# Altium project SCOM_2_IN_1_JLC_STACKUP_PROD.PrjPcb
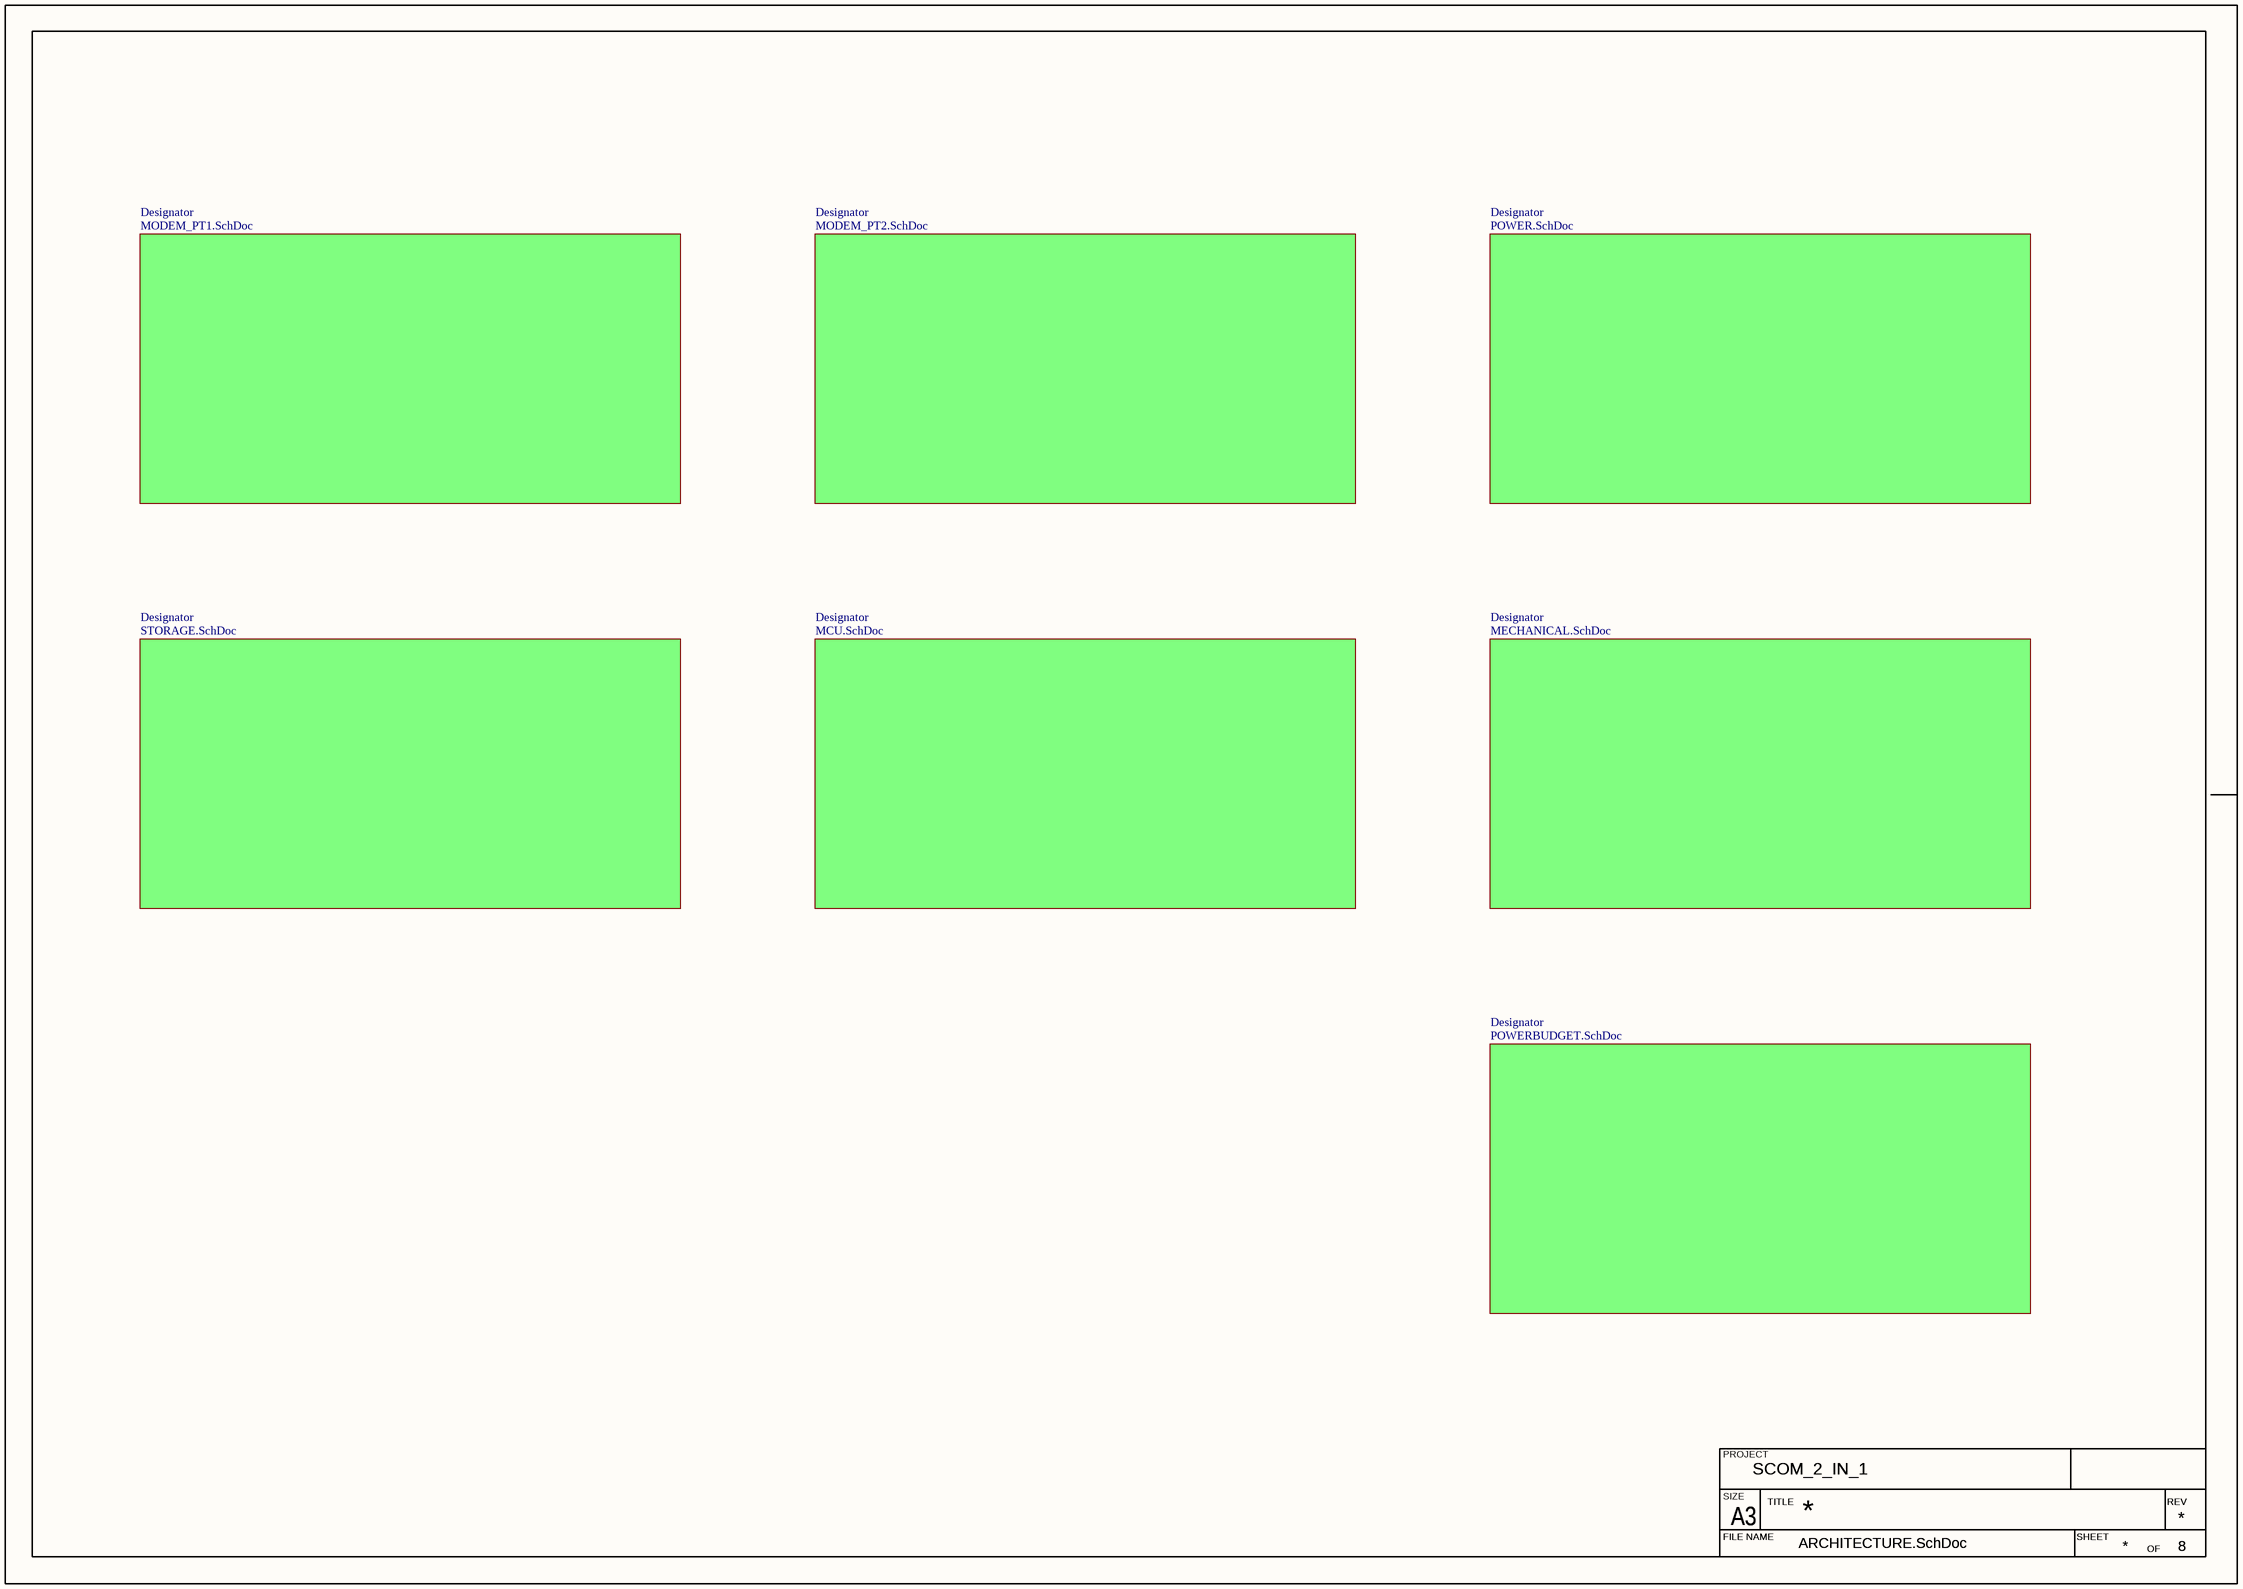
[diagram p0: ARCHITECTURE.SchDoc]
Project: SCOM_2_IN_1; Rev: 1.0; SheetTotal: 8
8 sheets, 145 parts. Net scope: global (net labels, ports and power ports of the same name join across sheets).
Board file: SCOM_2_IN_1_JLC_STACKUP_PROD.PcbDoc
Sheets:
  ARCHITECTURE.SchDoc
    Designator = MCU.SchDoc
    Designator = MODEM_PT2.SchDoc
    Designator = MECHANICAL.SchDoc
    Designator = STORAGE.SchDoc
    Designator = MODEM_PT1.SchDoc
    Designator = POWER.SchDoc
    Designator = POWERBUDGET.SchDoc

## Sheet ARCHITECTURE.SchDoc
size 420 x 297 mm

### Sub-sheets
Designator = MCU.SchDoc: no entries
Designator = MODEM_PT2.SchDoc: no entries
Designator = MECHANICAL.SchDoc: no entries
Designator = STORAGE.SchDoc: no entries
Designator = MODEM_PT1.SchDoc: no entries
Designator = POWER.SchDoc: no entries
Designator = POWERBUDGET.SchDoc: no entries

### Notes on the sheet
- PROJECT
- SIZE
- FILE NAME
- A3
- TITLE
- SHEET
- OF
- REV

## Sheet MCU.SchDoc: ESP32 MCU, LORA RFM95
size 420 x 297 mm; Revision: 1.0; SheetNumber: 6; SheetTotal: 8
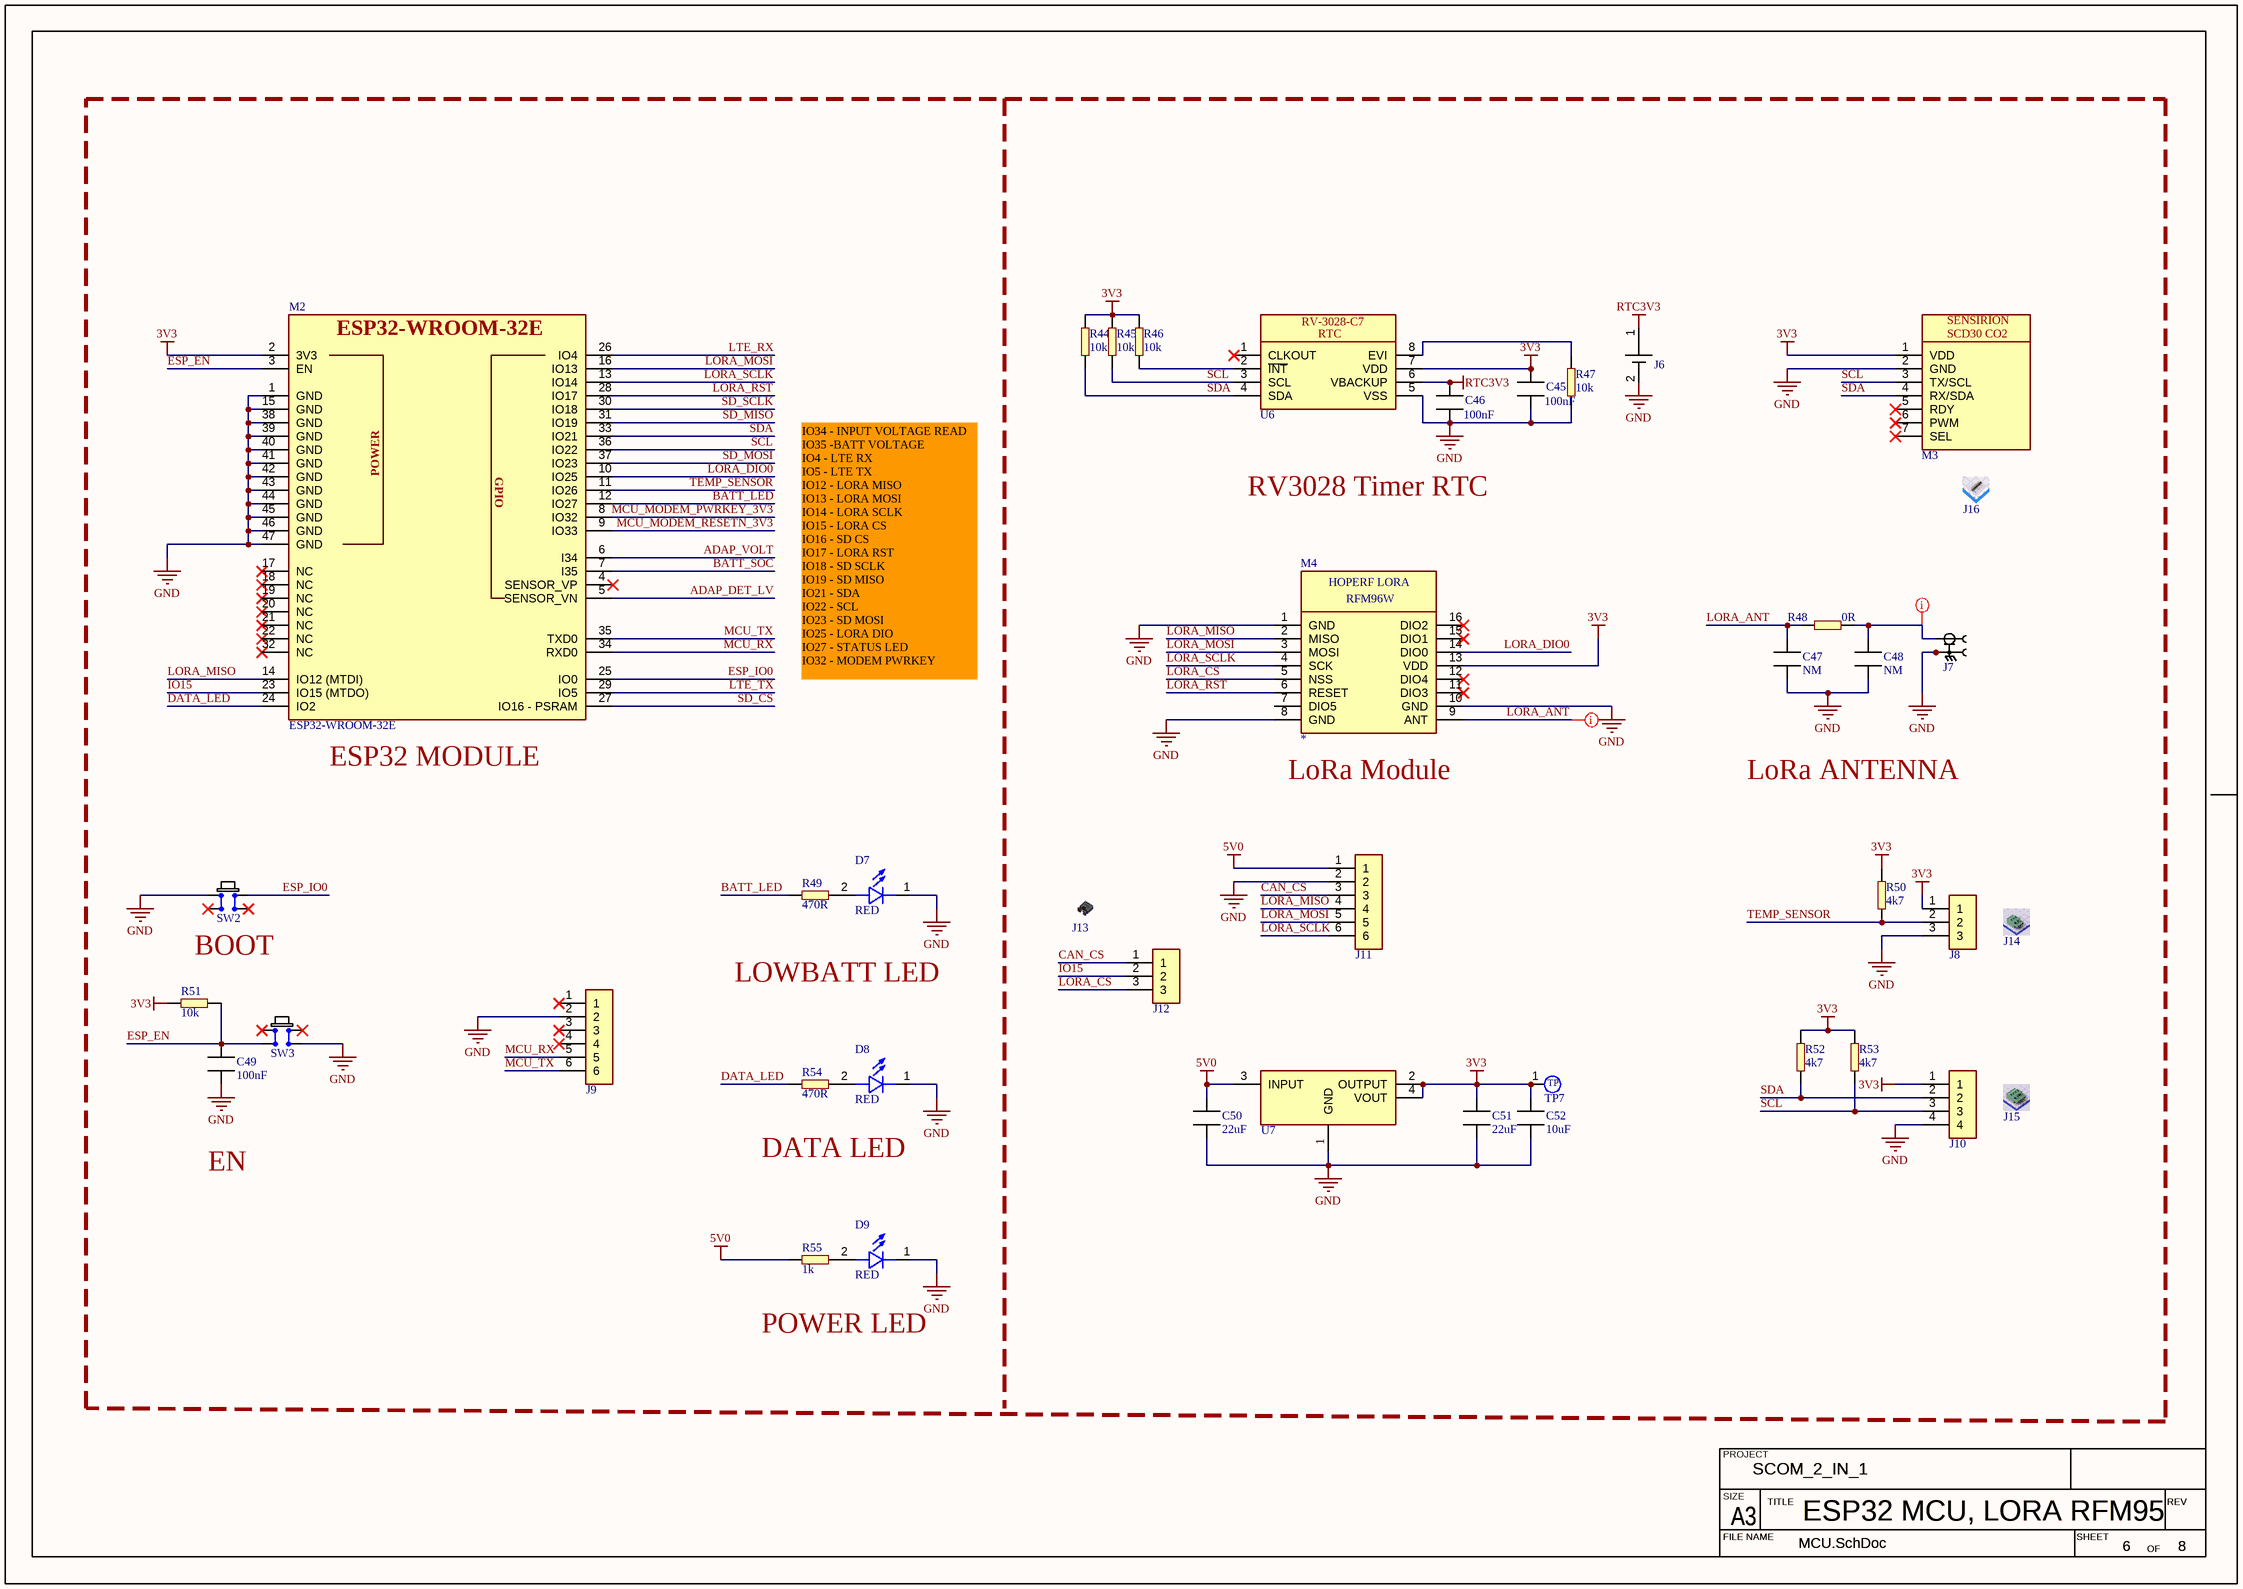
[diagram p1: MCU.SchDoc]

### Parts
C45  value 100nF  [CAPC2012X13L]  (hidden comment: MLCC_0805)
C46  value 100nF  [CAPC2012X13L]  (hidden comment: MLCC_0805)
C47  value NM  [CAPC0603X03L]  (hidden comment: ERP_102-1)  (no BOM)
C48  value NM  [CAPC0603X03L]  (hidden comment: ERP_102-1)  (no BOM)
C49  value 100nF  [CAPC2012X13L]  (hidden comment: MLCC_0805)
C50  value 22uF  [CAPC2012X13L]  (hidden comment: MLCC_0805)
C51  value 22uF  [CAPC2012X13L]  (hidden comment: MLCC_0805)
C52  value 10uF  [CAPC2012X13L]  (hidden comment: MLCC_0805)
D7  value RED  [LED_1206]  (hidden comment: LED_1206)
D8  value RED  [LED_1206]  (hidden comment: LED_1206)
D9  value RED  [LED_1206]  (hidden comment: LED_1206)
J6  CR1220-BH  [CR1220-BH]  (value not drawn)
J7  ERP_148-1  [uFL_50R]  (value not drawn)
J8  Terminal_Block_3Pin_5.08P  [TB_PLUG_5.08P_3P]  (value not drawn)
J9  ERP_148-2  [6PX1R_F]  (value not drawn)
J10  Terminal_Block_4Pin_5.08P  [TB_PLUG_5.08P_4P]  (value not drawn)
J11  ERP_148-2  [6PX1R_F]  (value not drawn)
J12  3PX1R_M  [3PX1R_THT]  (value not drawn)
J13  Jumper Cap  [Jumper Cap]  (value not drawn)
J14  SCTRM_5P08_3P  [SCTRM_5P08_3P]  (value not drawn)
J15  SCTRM_5P08_4P  [SCTRM_5P08_4P]  (value not drawn)
J16  PH_M_2P54_7P_RA  [PH_M_2P54_7P_RA]  (value not drawn)
M2  ESP32-WROOM-32E  [ESP32-WROOM-32UE]
M3  SCD30  [SCD30]  (value not drawn)
M4  RFM96W  [RFM96W]  (value not drawn)
R44  value 10k  [RES_0603]  (hidden comment: ERP_101-1)
R45  value 10k  [RES_0603]  (hidden comment: ERP_101-1)
R46  value 10k  [RES_0603]  (hidden comment: ERP_101-1)
R47  value 10k  [RES_0603]  (hidden comment: ERP_101-1)
R48  value 0R  [RESC0603X03L]  (hidden comment: ERP_101-1)
R49  value 470R  [RES_0603]  (hidden comment: ERP_101-1)
R50  value 4k7  [RES_0603]  (hidden comment: ERP_101-1)
R51  value 10k  [RES_0603]  (hidden comment: ERP_101-1)
R52  value 4k7  [RES_0603]  (hidden comment: ERP_101-1)
R53  value 4k7  [RES_0603]  (hidden comment: ERP_101-1)
R54  value 470R  [RES_0603]  (hidden comment: ERP_101-1)
R55  value 1k  [RES_0603]  (hidden comment: ERP_101-1)
SW2  Generic6X6  [Generic6X6]  (value not drawn)
SW3  Generic6X6  [Generic6X6]  (value not drawn)
TP7  TP_1MM  [TP_1MM]  (value not drawn)  (no BOM)
U6  RV-3028-C7  [RV-3028-C7]  (value not drawn)
U7  ERP_123-1  [AMS1117_SOT223]  (value not drawn)

### Nets
3V3: C45.1 C51.1 C52.1 J8.1 J10.1 M2.2(3V3) M3.1(VDD) M4.13(VDD) R44.2 R45.2 R46.2 R50.1 R51.2 R52.1 R53.1 TP7.1 U6.7(VDD) U7.2(OUTPUT) U7.4(VOUT)
5V0: C50.1 J11.1 R55.2 U7.3(INPUT)
GND: C45.2 C46.2 C47.1 C48.1 C49.2 C50.2 C51.2 C52.2 D7.1 D8.1 D9.1 J6.2(-) J7.1 J7.2 J8.3 J9.2 J10.4 J11.2 M2.1(GND) M2.15(GND) M2.38(GND) M2.39(GND) M2.40(GND) M2.41(GND) M2.42(GND) M2.43(GND) M2.44(GND) M2.45(GND) M2.46(GND) M2.47(GND) M3.2(GND) M4.1(GND) M4.8(GND) M4.10(GND) R47.1 SW2.1(NO) SW3.4(COM) U6.5(VSS) U7.1(GND)
RTC3V3: C46.1 J6.1(+) U6.6(VBACKUP)
ADAP_DET_LV: M2.5(SENSOR_VN)
ADAP_VOLT: M2.6(I34)
BATT_LED: M2.12(IO27) R49.2
BATT_SOC: M2.7(I35)
CAN_CS: J11.3 J12.1
DATA_LED: M2.24(IO2) R54.2
ESP_EN: C49.1 M2.3(EN) R51.1 SW3.2(NO)
ESP_IO0: M2.25(IO0) SW2.3(COM)
IO15: J12.2 M2.23(IO15_(MTDO))
LORA_ANT: C47.2 M4.9(ANT) R48.2
LORA_CS: J12.3 M4.5(NSS)
LORA_DIO0: M2.10(IO25) M4.14(DIO0)
LORA_MISO: J11.4 M2.14(IO12_(MTDI)) M4.2(MISO)
LORA_MOSI: J11.5 M2.16(IO13) M4.3(MOSI)
LORA_RST: M2.28(IO17) M4.6(RESET)
LORA_SCLK: J11.6 M2.13(IO14) M4.4(SCK)
LTE_RX: M2.26(IO4)
LTE_TX: M2.29(IO5)
MCU_MODEM_PWRKEY_3V3: M2.8(IO32)
MCU_MODEM_RESETN_3V3: M2.9(IO33)
MCU_RX: J9.5 M2.34(RXD0)
MCU_TX: J9.6 M2.35(TXD0)
SCL: J10.3 M2.36(IO22) M3.3(TX/SCL) R45.1 R53.2 U6.3(SCL)
SD_CS: M2.27(IO16_-_PSRAM)
SD_MISO: M2.31(IO19)
SD_MOSI: M2.37(IO23)
SD_SCLK: M2.30(IO18)
SDA: J10.2 M2.33(IO21) M3.4(RX/SDA) R44.1 R52.2 U6.4(SDA)
TEMP_SENSOR: J8.2 M2.11(IO26) R50.2
NetC48_2: C48.2 J7.3 R48.1
NetD7_2: D7.2 R49.1
NetD8_2: D8.2 R54.1
NetD9_2: D9.2 R55.1
NetR46_1: R46.1 U6.2(~{INT})
NetR47_2: R47.2 U6.8(EVI)

Not connected (* = marked no-connect by the designer): J9 1* 3* 4*; M2 4(SENSOR_VP)* 17(NC)* 18(NC)* 19(NC)* 20(NC)* 21(NC)* 22(NC)* 32(NC)*; M3 5(RDY)* 6(PWM)* 7(SEL)*; M4 7(DIO5) 11(DIO3)* 12(DIO4)* 15(DIO1)* 16(DIO2)*; SW2 2(NO)* 4(COM)*; SW3 1(NO)* 3(COM)*; U6 1(CLKOUT)*

### Layout directives
net class ANT_50R; rule Width Constraint [Pref Impedance = 50.00ohms    Min Impedance = 50.00ohms    Max Impedance = 50.00ohms]: LORA_ANT, NetC48_2

### Notes on the sheet
- RV3028 Timer RTC
- IO34 - INPUT VOLTAGE READ
  IO35 -BATT VOLTAGE
  IO4 - LTE RX
  IO5 - LTE TX
  IO12 - LORA MISO
  IO13 - LORA MOSI
  IO14 - LORA SCLK
  IO15 - LORA CS
  IO16 - SD CS
  IO17 - LORA RST
  IO18 - SD SCLK
  IO19 - SD MISO
  IO21 - SDA
  IO22 - SCL
  IO23 - SD MOSI
  IO25 - LORA DIO
  IO27 - STATUS LED
  IO32 - MODEM PWRKEY
- (near M2) ESP32 MODULE
- (near M4) LoRa Module
- LoRa ANTENNA
- (near SW2) BOOT
- LOWBATT LED
- EN
- DATA LED
- POWER LED
- PROJECT
- SIZE
- FILE NAME
- A3
- TITLE
- SHEET
- OF
- REV
- (in symbol ESP32-WROOM-32E) POWER; GPIO
- (in symbol RFM96W) HOPERF LORA
- (in symbol RV-3028-C7) RTC
- (in symbol SCD30) SENSIRION; SCD30 CO2
- (in symbol TP_1MM) TP

### Library data of the parts
C45 C46 = MLCC_0805: 1uF 105 0805 (2012 metric) 50V X7R MLCC SMD; Package: 0805; Manufacturer 1: *; Manufacturer Part Number 1: *
C47 C48 = MLCC_0201: Chip Capacitor, 2-Leads, Body 0.60x0.30mm, IPC High Density; Package: 0201; Manufacturer 1: *; Manufacturer Part Number 1: *
C49-C52 = MLCC_0805: Chip Capacitor, 2-Leads, Body 2.00x1.25mm, IPC High Density; Package: 0805; Manufacturer 1: *; Manufacturer Part Number 1: *
D7-D9 = LED_1206: LED CLEAR 1206 SMD; Manufacturer Part Number 1: 6395; Manufacturer 1: Sunrom
J6 = CR1220-BH: BATTERY HOLDER COIN 12.5MM SMD; Manufacturer 1: Keystone Electronics; Value: *; Manufacturer Part Number 1: *
J7 = uFL_50R: Package: L3W3; Value: *; ERP: *; Manufacturer 1: *; Manufacturer Part Number 1: *; Supplier 1: *; Suuplier Part Number 1: *
J8 = Terminal_Block_3Pin_5.08P: 3PINS TERMINAL BLOCK 5.08 PITCH; Manufacturer Part Number 1: *; Manufacturer 1: *; Supplier Part Number 1: *; Supplier 1: *; ERP: *; Package: 6PIN
J9 J11 = 6PX1R_F: 6PX1R Female Header; Value: *; Manufacturer 1: *; Manufacturer Part Number 1: *
J10 = Terminal_Block_4Pin_5.08P: 4PINS TERMINAL BLOCK 5.08 PITCH; Manufacturer Part Number 1: *; Manufacturer 1: *; Supplier Part Number 1: *; Supplier 1: *; ERP: *; Package: 6PIN
J12 = 3PX1R_M: 3PX1R Male Header; Value: C49257; Manufacturer 1: *; Manufacturer Part Number 1: *
J13 = Jumper Cap: 2 Pin Jumper Cap P2.54; Manufacturer Part Number 1: *; Manufacturer 1: *; Value: *
J14 = SCTRM_5P08_3P: Screw Terminal Female 3 Pin 5.08mm; Manufacturer Part Number 1: XY2500F-BV-5.08-3P; Manufacturer 1: Ningbo Xinlaiya Elec.; Value: *
J15 = SCTRM_5P08_4P: Screw Terminal Female 4 Pin 5.08mm; Manufacturer Part Number 1: XY2500F-BV-5.08-4P; Manufacturer 1: Ningbo Xinlaiya Elec.; Value: *
J16 = PH_M_2P54_7P_RA: Male Pin Header P 5.08mm 7 Pin Right Angle; Manufacturer Part Number 1: PZ254R-11-07P; Manufacturer 1: XFCN; Value: *
M2 = ESP32-WROOM-32E: ESP32-WROOM-32E Module; Manufacturer 1: Espressif Systems; Manufacturer Part Number 1: *; Package: *; Value: ESP32-WROOM-32E
M3 = SCD30: CO₂ accuracy of ±(30 ppm + 3% MV) @400-10000 ppm; Manufacturer 1: *; Manufacturer Part Number 1: SCD30; Supplier 1: *; Supplier Part Number 1: *; ERP: *; Package: SOT-353
M4 = RFM96W: LoRa 868MHz SX1276 RF Transreceiver Module RFM96W; Manufacturer 1: *; Manufacturer Part Number 1: *; Value: *
R44-R47 R49-R55 = RES_0603: Package: 0603; Manufacturer 1: *; Manufacturer Part Number 1: *
  R44-R47: Supplier 1: *; Supplier Part Number 1: *; ERP: *
  R49 R50 R52-R55: ERP: *
R48 = RES_0201: Package: 0201; Manufacturer 1: *; Manufacturer Part Number 1: *
SW2 SW3 = Generic6X6: Tactile Switch SPST-NO Top Actuated Surface Mount; Manufacturer 1: C&K; Manufacturer Part Number 1: *; Package: 4.5X4.5
U6 = RV-3028-C7: IC RTC CLK/CALENDAR I2C 8SON; Manufacturer 1: Micro Crystal AG; Manufacturer Part Number 1: RV-3028-C7 32.768KHZ 1PPM-TA-QC; Value: *
U7 = AMS1117_SOT223: AMS1117 LDO; Manufacturer 1: TI; Supplier  Part Number 1: *; Supplier  1: *; Package: SOT223; Manufacturer Part Number 1: *

## Sheet MODEM_PT2.SchDoc
size 420 x 297 mm; SheetNumber: 4; SheetTotal: 8
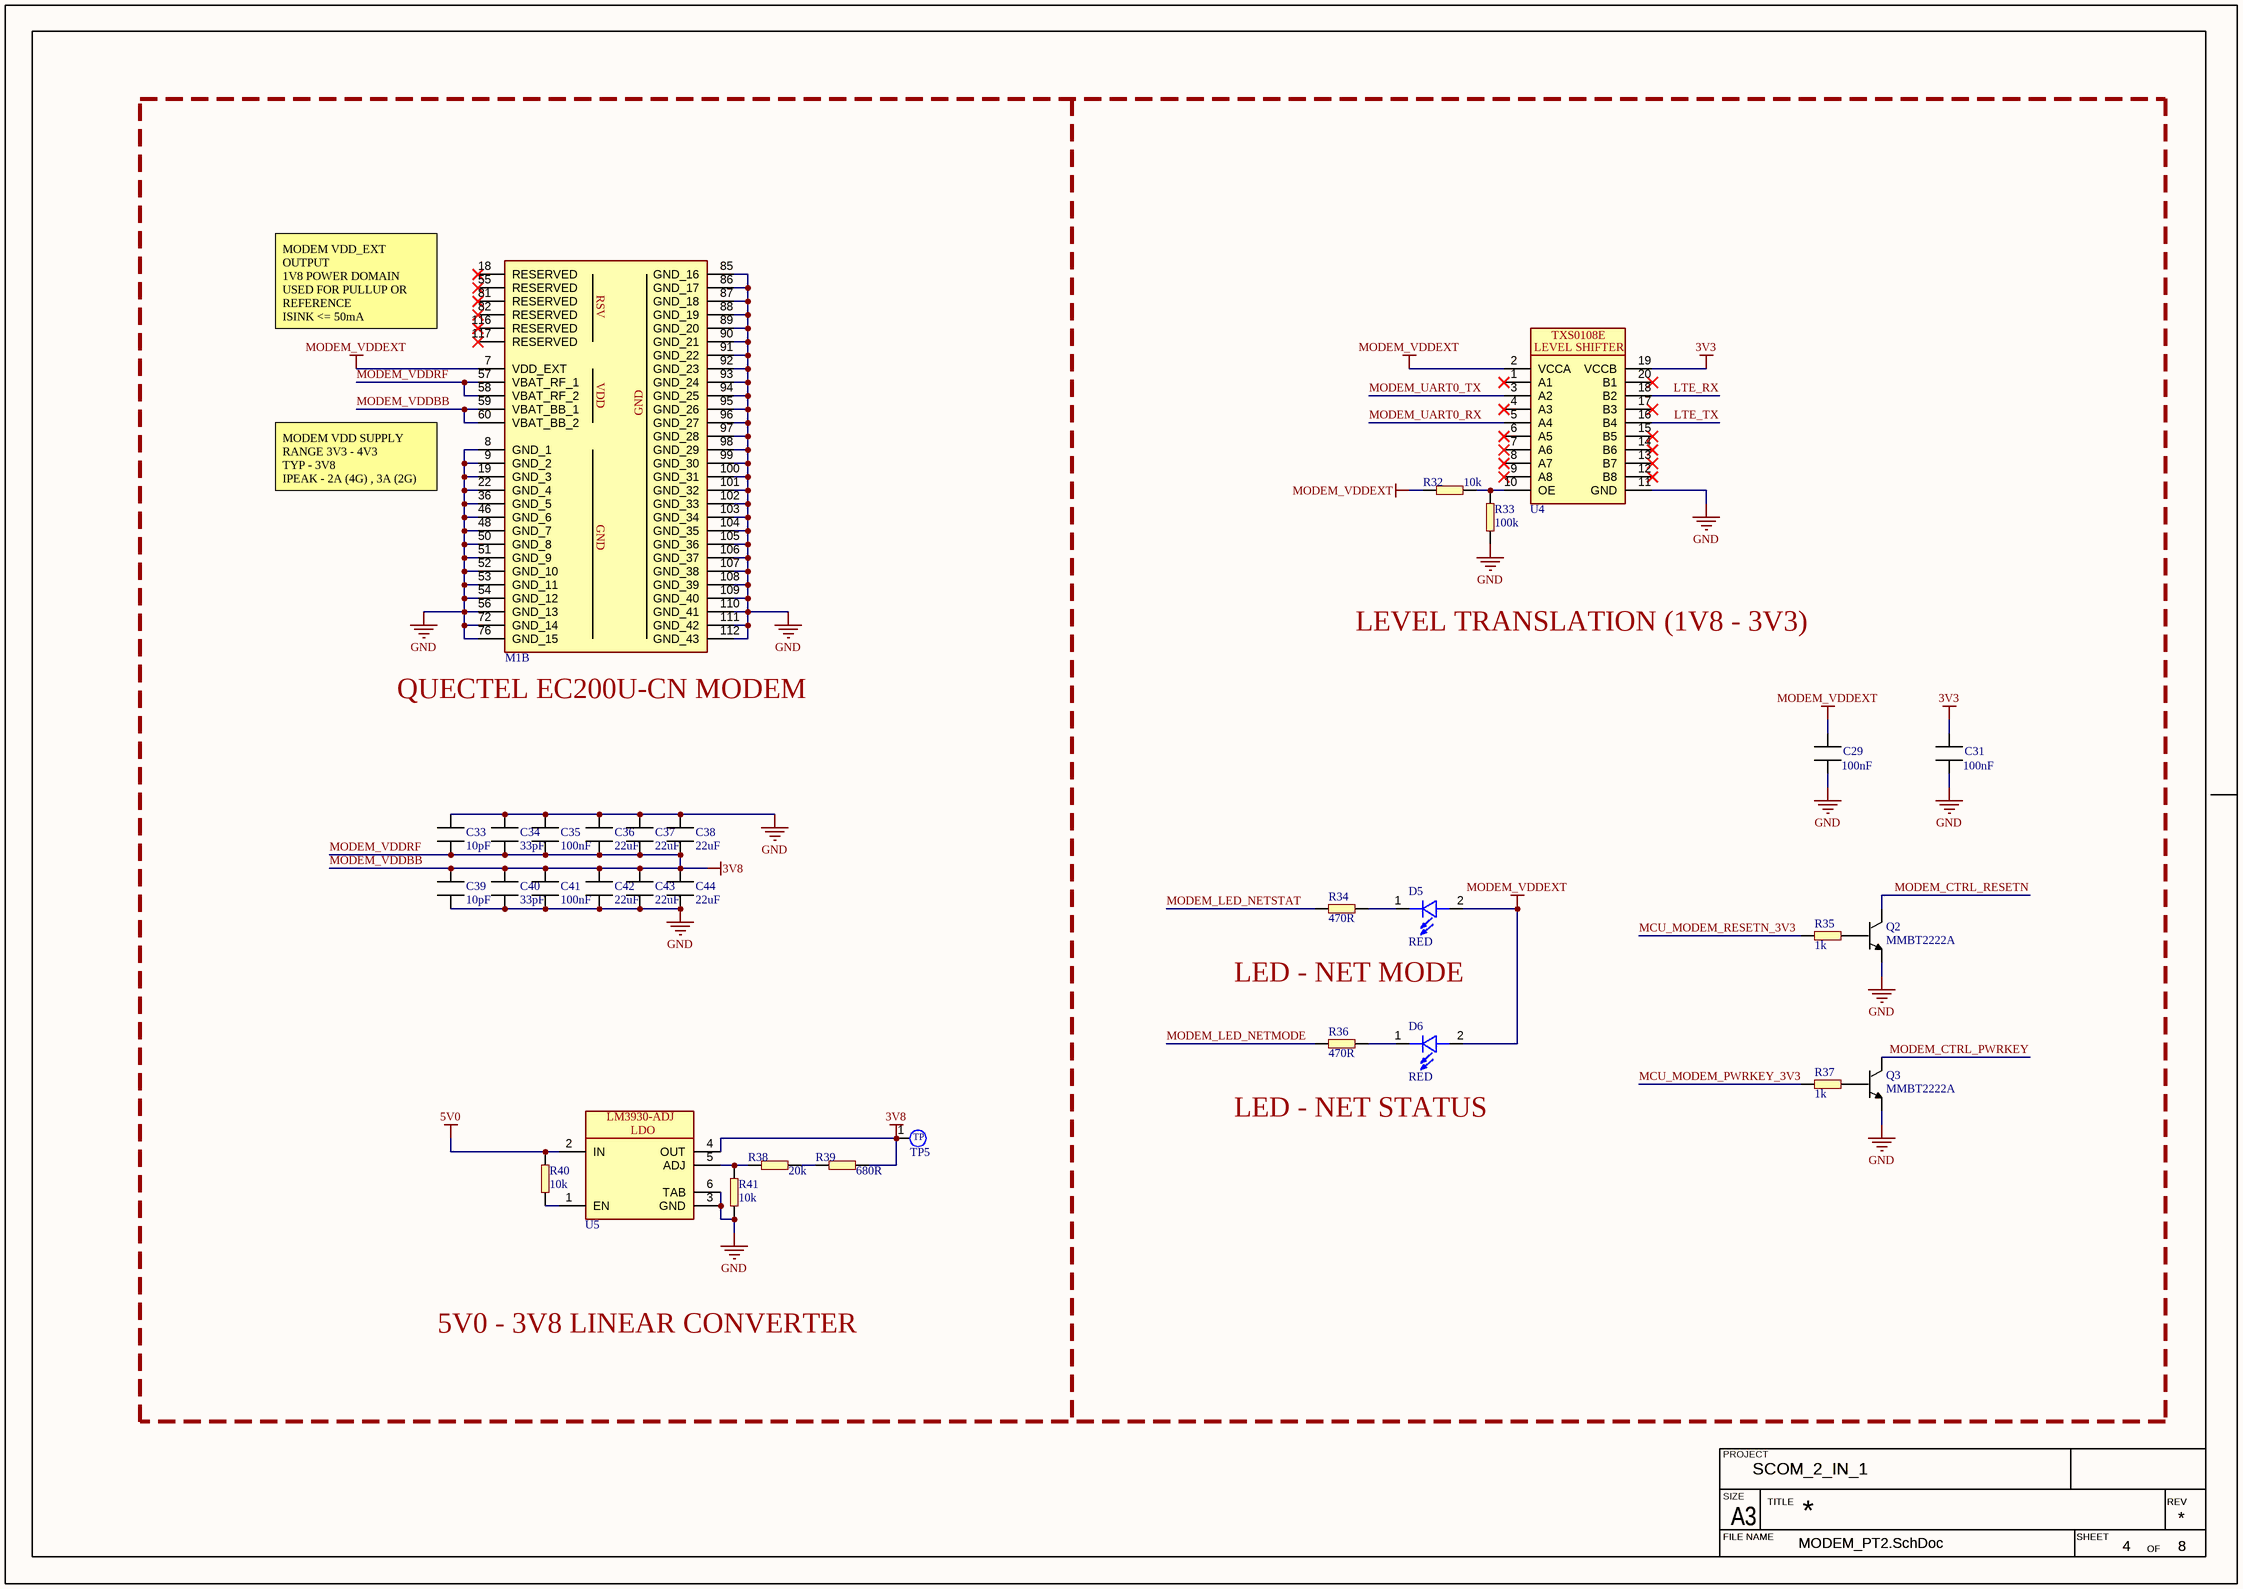
[diagram p2: MODEM_PT2.SchDoc]

### Parts
C29  value 100nF  [CAPC2012X13L]  (hidden comment: MLCC_0805)
C31  value 100nF  [CAPC2012X13L]  (hidden comment: MLCC_0805)
C33  value 10pF  [CAPC2012X13L]  (hidden comment: MLCC_0805)
C34  value 33pF  [CAPC2012X13L]  (hidden comment: MLCC_0805)
C35  value 100nF  [CAPC2012X13L]  (hidden comment: MLCC_0805)
C36  value 22uF  [CAPC2012X13L]  (hidden comment: MLCC_0805)
C37  value 22uF  [CAPC2012X13L]  (hidden comment: MLCC_0805)
C38  value 22uF  [CAPC2012X13L]  (hidden comment: MLCC_0805)
C39  value 10pF  [CAPC2012X13L]  (hidden comment: MLCC_0805)
C40  value 33pF  [CAPC2012X13L]  (hidden comment: MLCC_0805)
C41  value 100nF  [CAPC2012X13L]  (hidden comment: MLCC_0805)
C42  value 22uF  [CAPC2012X13L]  (hidden comment: MLCC_0805)
C43  value 22uF  [CAPC2012X13L]  (hidden comment: MLCC_0805)
C44  value 22uF  [CAPC2012X13L]  (hidden comment: MLCC_0805)
D5  value RED  [LED_1206]  (hidden comment: LED_1206)
D6  value RED  [LED_1206]  (hidden comment: LED_1206)
M1  EC200U  [EC200U]  (value not drawn)  (part B of 2)
Q2  value MMBT2222A  [MMBT2222]  (hidden comment: ERP_105-1)
Q3  value MMBT2222A  [MMBT2222]  (hidden comment: ERP_105-1)
R32  value 10k  [RES_0603]  (hidden comment: ERP_101-1)
R33  value 100k  [RES_0603]  (hidden comment: ERP_101-1)
R34  value 470R  [RES_0603]  (hidden comment: ERP_101-1)
R35  value 1k  [RES_0603]  (hidden comment: ERP_101-1)
R36  value 470R  [RES_0603]  (hidden comment: ERP_101-1)
R37  value 1k  [RES_0603]  (hidden comment: ERP_101-1)
R38  value 20k  [RES_0603]  (hidden comment: ERP_101-1)
R39  value 680R  [RES_0603]  (hidden comment: ERP_101-1)
R40  value 10k  [RES_0603]  (hidden comment: ERP_101-1)
R41  value 10k  [RES_0603]  (hidden comment: ERP_101-1)
TP5  TP_1MM  [TP_1MM]  (value not drawn)  (no BOM)
U4  TXS0108EPW  [TXS0108EPW]  (value not drawn)
U5  LM39302  [DPAK170P1491X483-6N]  (value not drawn)

### Nets
3V3: C31.1 U4.19(VCCB)
5V0: R40.1 U5.2(IN)
GND: C29.2 C31.2 C33.1 C34.1 C35.1 C36.1 C37.1 C38.1 C39.2 C40.2 C41.2 C42.2 C43.2 C44.2 M1.8(GND_1) M1.9(GND_2) M1.19(GND_3) M1.22(GND_4) M1.36(GND_5) M1.46(GND_6) M1.48(GND_7) M1.50(GND_8) M1.51(GND_9) M1.52(GND_10) M1.53(GND_11) M1.54(GND_12) M1.56(GND_13) M1.72(GND_14) M1.76(GND_15) M1.85(GND_16) M1.86(GND_17) M1.87(GND_18) M1.88(GND_19) M1.89(GND_20) M1.90(GND_21) M1.91(GND_22) M1.92(GND_23) M1.93(GND_24) M1.94(GND_25) M1.95(GND_26) M1.96(GND_27) M1.97(GND_28) M1.98(GND_29) M1.99(GND_30) M1.100(GND_31) M1.101(GND_32) M1.102(GND_33) M1.103(GND_34) M1.104(GND_35) M1.105(GND_36) M1.106(GND_37) M1.107(GND_38) M1.108(GND_39) M1.109(GND_40) M1.110(GND_41) M1.111(GND_42) M1.112(GND_43) Q2.2 Q3.2 R33.2 R41.2 U4.11(GND) U5.3(GND) U5.6(TAB)
MODEM_VDDBB: C33.2 C34.2 C35.2 C36.2 C37.2 C38.2 C39.1 C40.1 C41.1 C42.1 C43.1 C44.1 M1.57(VBAT_RF_1) M1.58(VBAT_RF_2) M1.59(VBAT_BB_1) M1.60(VBAT_BB_2) R39.1 TP5.1 U5.4(OUT)  [also labelled 3V8, MODEM_VDDRF]
MODEM_VDDEXT: C29.1 D5.2 D6.2 M1.7(VDD_EXT) R32.2 U4.2(VCCA)
LTE_RX: U4.18(B2)
LTE_TX: U4.16(B4)
MCU_MODEM_PWRKEY_3V3: R37.2
MCU_MODEM_RESETN_3V3: R35.2
MODEM_CTRL_PWRKEY: Q3.3
MODEM_CTRL_RESETN: Q2.3
MODEM_LED_NETMODE: R36.2
MODEM_LED_NETSTAT: R34.2
MODEM_UART0_RX: U4.5(A4)
MODEM_UART0_TX: U4.3(A2)
NetD5_1: D5.1 R34.1
NetD6_1: D6.1 R36.1
NetQ2_1: Q2.1 R35.1
NetQ3_1: Q3.1 R37.1
NetR32_1: R32.1 R33.1 U4.10(OE)
NetR38_1: R38.1 R39.2
NetR38_2: R38.2 R41.1 U5.5(ADJ)
NetR40_2: R40.2 U5.1(EN)

Not connected (* = marked no-connect by the designer): M1 18(RESERVED)* 55(RESERVED)* 81(RESERVED)* 82(RESERVED)* 116(RESERVED)* 117(RESERVED)*; U4 1(A1)* 4(A3)* 6(A5)* 7(A6)* 8(A7)* 9(A8)* 12(B8)* 13(B7)* 14(B6)* 15(B5)* 17(B3)* 20(B1)*

### Notes on the sheet
- MODEM VDD_EXT OUTPUT
  1V8 POWER DOMAIN
  USED FOR PULLUP OR REFERENCE
  ISINK <= 50mA
- MODEM VDD SUPPLY
  RANGE 3V3 - 4V3
  TYP - 3V8
  IPEAK - 2A (4G) , 3A (2G)
- LEVEL TRANSLATION (1V8 - 3V3)
- (near M1) QUECTEL EC200U-CN MODEM
- LED - NET MODE
- LED - NET STATUS
- 5V0 - 3V8 LINEAR CONVERTER
- PROJECT
- SIZE
- FILE NAME
- A3
- TITLE
- SHEET
- OF
- REV
- (in symbol EC200U, part B) RSV; VDD; GND
- (in symbol LM39302) LM3930-ADJ; LDO
- (in symbol TP_1MM) TP
- (in symbol TXS0108EPW) TXS0108E; LEVEL SHIFTER

### Library data of the parts
C29 C31 C33-C44 = MLCC_0805: as C49 on sheet MCU; Package: 0805; Manufacturer 1: *; Manufacturer Part Number 1: *
D5 D6 = LED_1206: as D7 on sheet MCU
M1 = EC200U: LTE CAT1 MODEM 144 SMD; Manufacturer 1: Quectel; Manufacturer Part Number 1: 027-EC200UCNAA-N05-SGNSA; Value: *
Q2 Q3 = MMBT2222: MMBT2222A; ERP: *; Suuplier Part Number 1: *; Supplier 1: *; Manufacturer Part Number 1: *; Manufacturer 1: *; Package: SOT23
R32-R41 = RES_0603: Package: 0603; Manufacturer 1: *; Manufacturer Part Number 1: *
  R34-R41: ERP: *
U4 = TXS0108EPW: Voltage Level Translator Bidirectional 1 Circuit 8 Channel 60Mbps 20-TSSOP; Manufacturer Part Number 1: TXS0108EPWR; Manufacturer 1: Texas Instruments; Package: 20-TSSOP; Value: *
U5 = LM39302: LM39302R HTC TO263 - Adjustable 3A Low-Voltage Low-Dropout Regulator; Manufacturer Part Number 1: *; Manufacturer 1: *; Value: *

## Sheet MECHANICAL.SchDoc
size 420 x 297 mm

### Notes on the sheet
- PROJECT
- SIZE
- FILE NAME
- A3
- TITLE
- SHEET
- OF
- REV

## Sheet STORAGE.SchDoc
size 420 x 297 mm; SheetNumber: 5; SheetTotal: 8
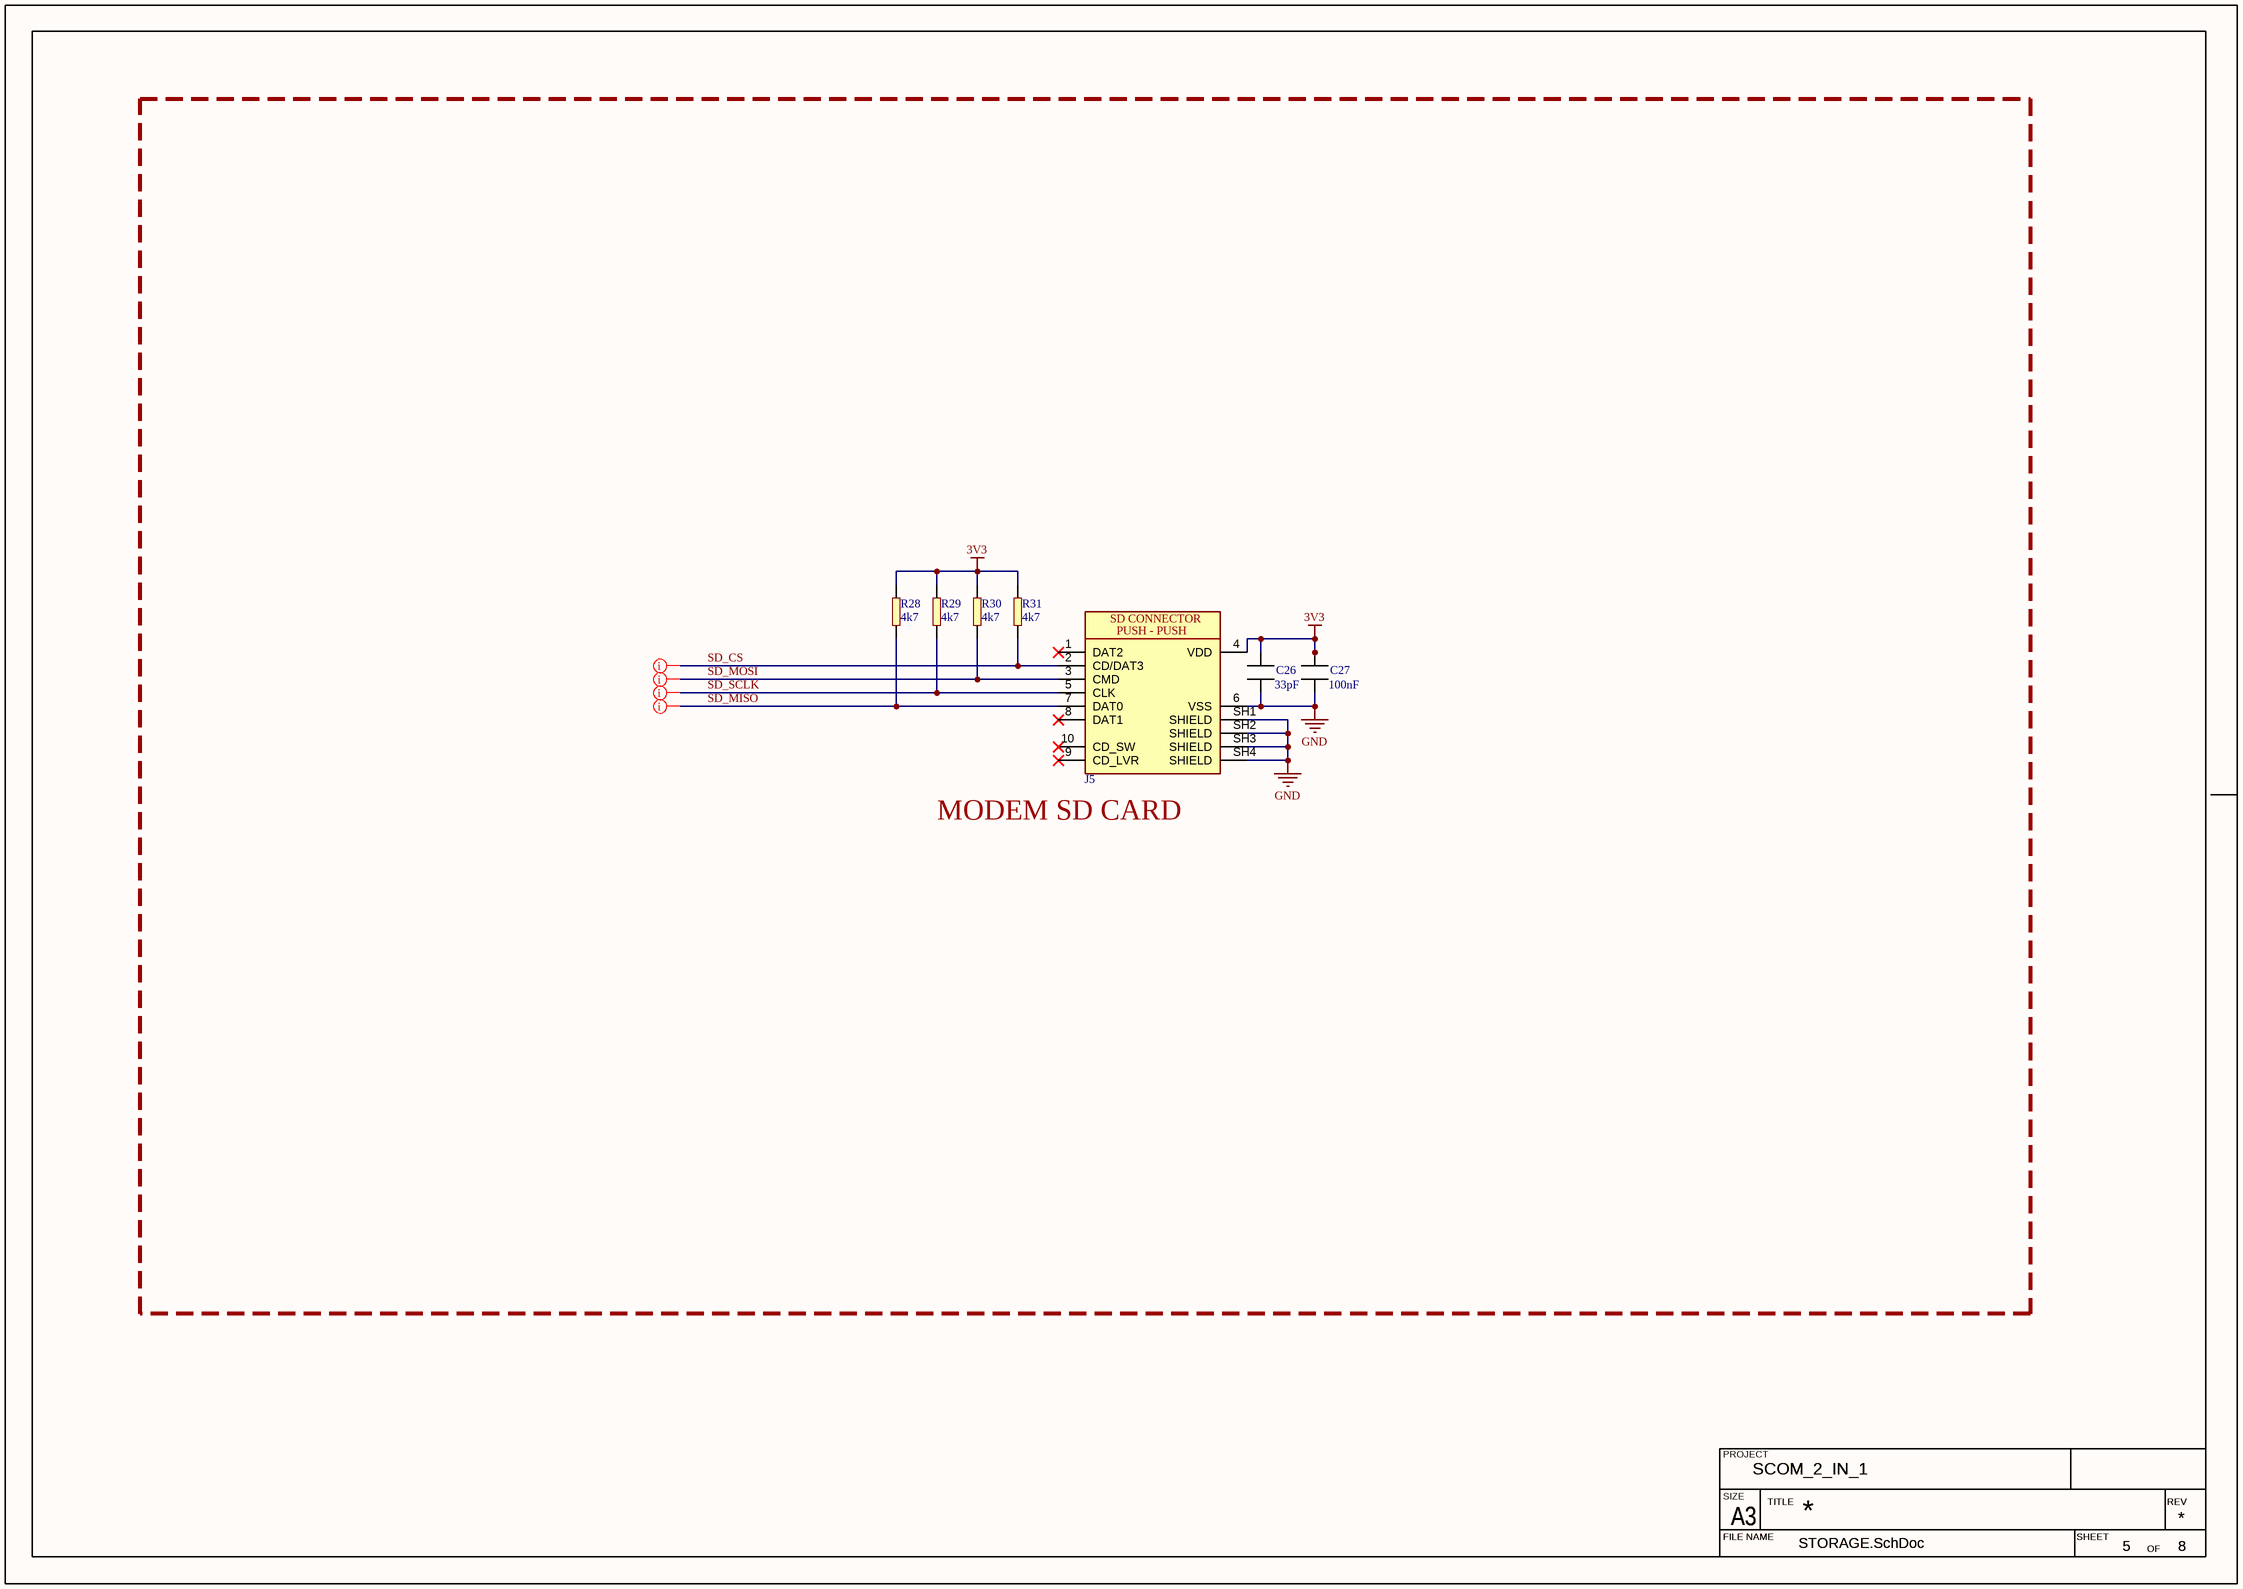
[diagram p3: STORAGE.SchDoc]

### Parts
C26  value 33pF  [CAPC2012X13L]  (hidden comment: MLCC_0805)
C27  value 100nF  [CAPC2012X13L]  (hidden comment: MLCC_0805)
J5  5033981892  [5033981892]  (value not drawn)
R28  value 4k7  [RES_0603]  (hidden comment: ERP_101-1)
R29  value 4k7  [RES_0603]  (hidden comment: ERP_101-1)
R30  value 4k7  [RES_0603]  (hidden comment: ERP_101-1)
R31  value 4k7  [RES_0603]  (hidden comment: ERP_101-1)

### Blocks framed on the sheet
MODEM SD CARD: C26 C27 J5 R28-R31

### Nets
3V3: C26.1 C27.1 J5.4(VDD) R28.2 R29.2 R30.2 R31.2
GND: C26.2 C27.2 J5.6(VSS) J5.SH1(SHIELD) J5.SH2(SHIELD) J5.SH3(SHIELD) J5.SH4(SHIELD)
SD_CS: J5.2(CD/DAT3) R31.1
SD_MISO: J5.7(DAT0) R28.1
SD_MOSI: J5.3(CMD) R30.1
SD_SCLK: J5.5(CLK) R29.1

Not connected (* = marked no-connect by the designer): J5 1(DAT2)* 8(DAT1)* 9(CD_LVR)* 10(CD_SW)*

### Layout directives
rule Width Constraint [Pref Impedance = 50.00ohms    Min Impedance = 50.00ohms    Max Impedance = 50.00ohms]: SD_CS, SD_MISO, SD_MOSI, SD_SCLK

### Notes on the sheet
- PROJECT
- SIZE
- FILE NAME
- A3
- TITLE
- SHEET
- OF
- REV
- (in symbol 5033981892) SD CONNECTOR; PUSH - PUSH

### Library data of the parts
C26 C27 = MLCC_0805: as C49 on sheet MCU; Package: 0805; Manufacturer 1: *; Manufacturer Part Number 1: *
J5 = 5033981892: 9 (8 + 1) Position Card Connector Secure Digital - microSD™ Surface Mount, Right Angle Gold; Manufacturer 1: Molex; Manufacturer Part Number 1: 5033981892; Package: 9 (8+1); Value: *
R28-R31 = RES_0603: Package: 0603; Manufacturer 1: *; Manufacturer Part Number 1: *

## Sheet MODEM_PT1.SchDoc
size 420 x 297 mm; SheetNumber: 3; SheetTotal: 8
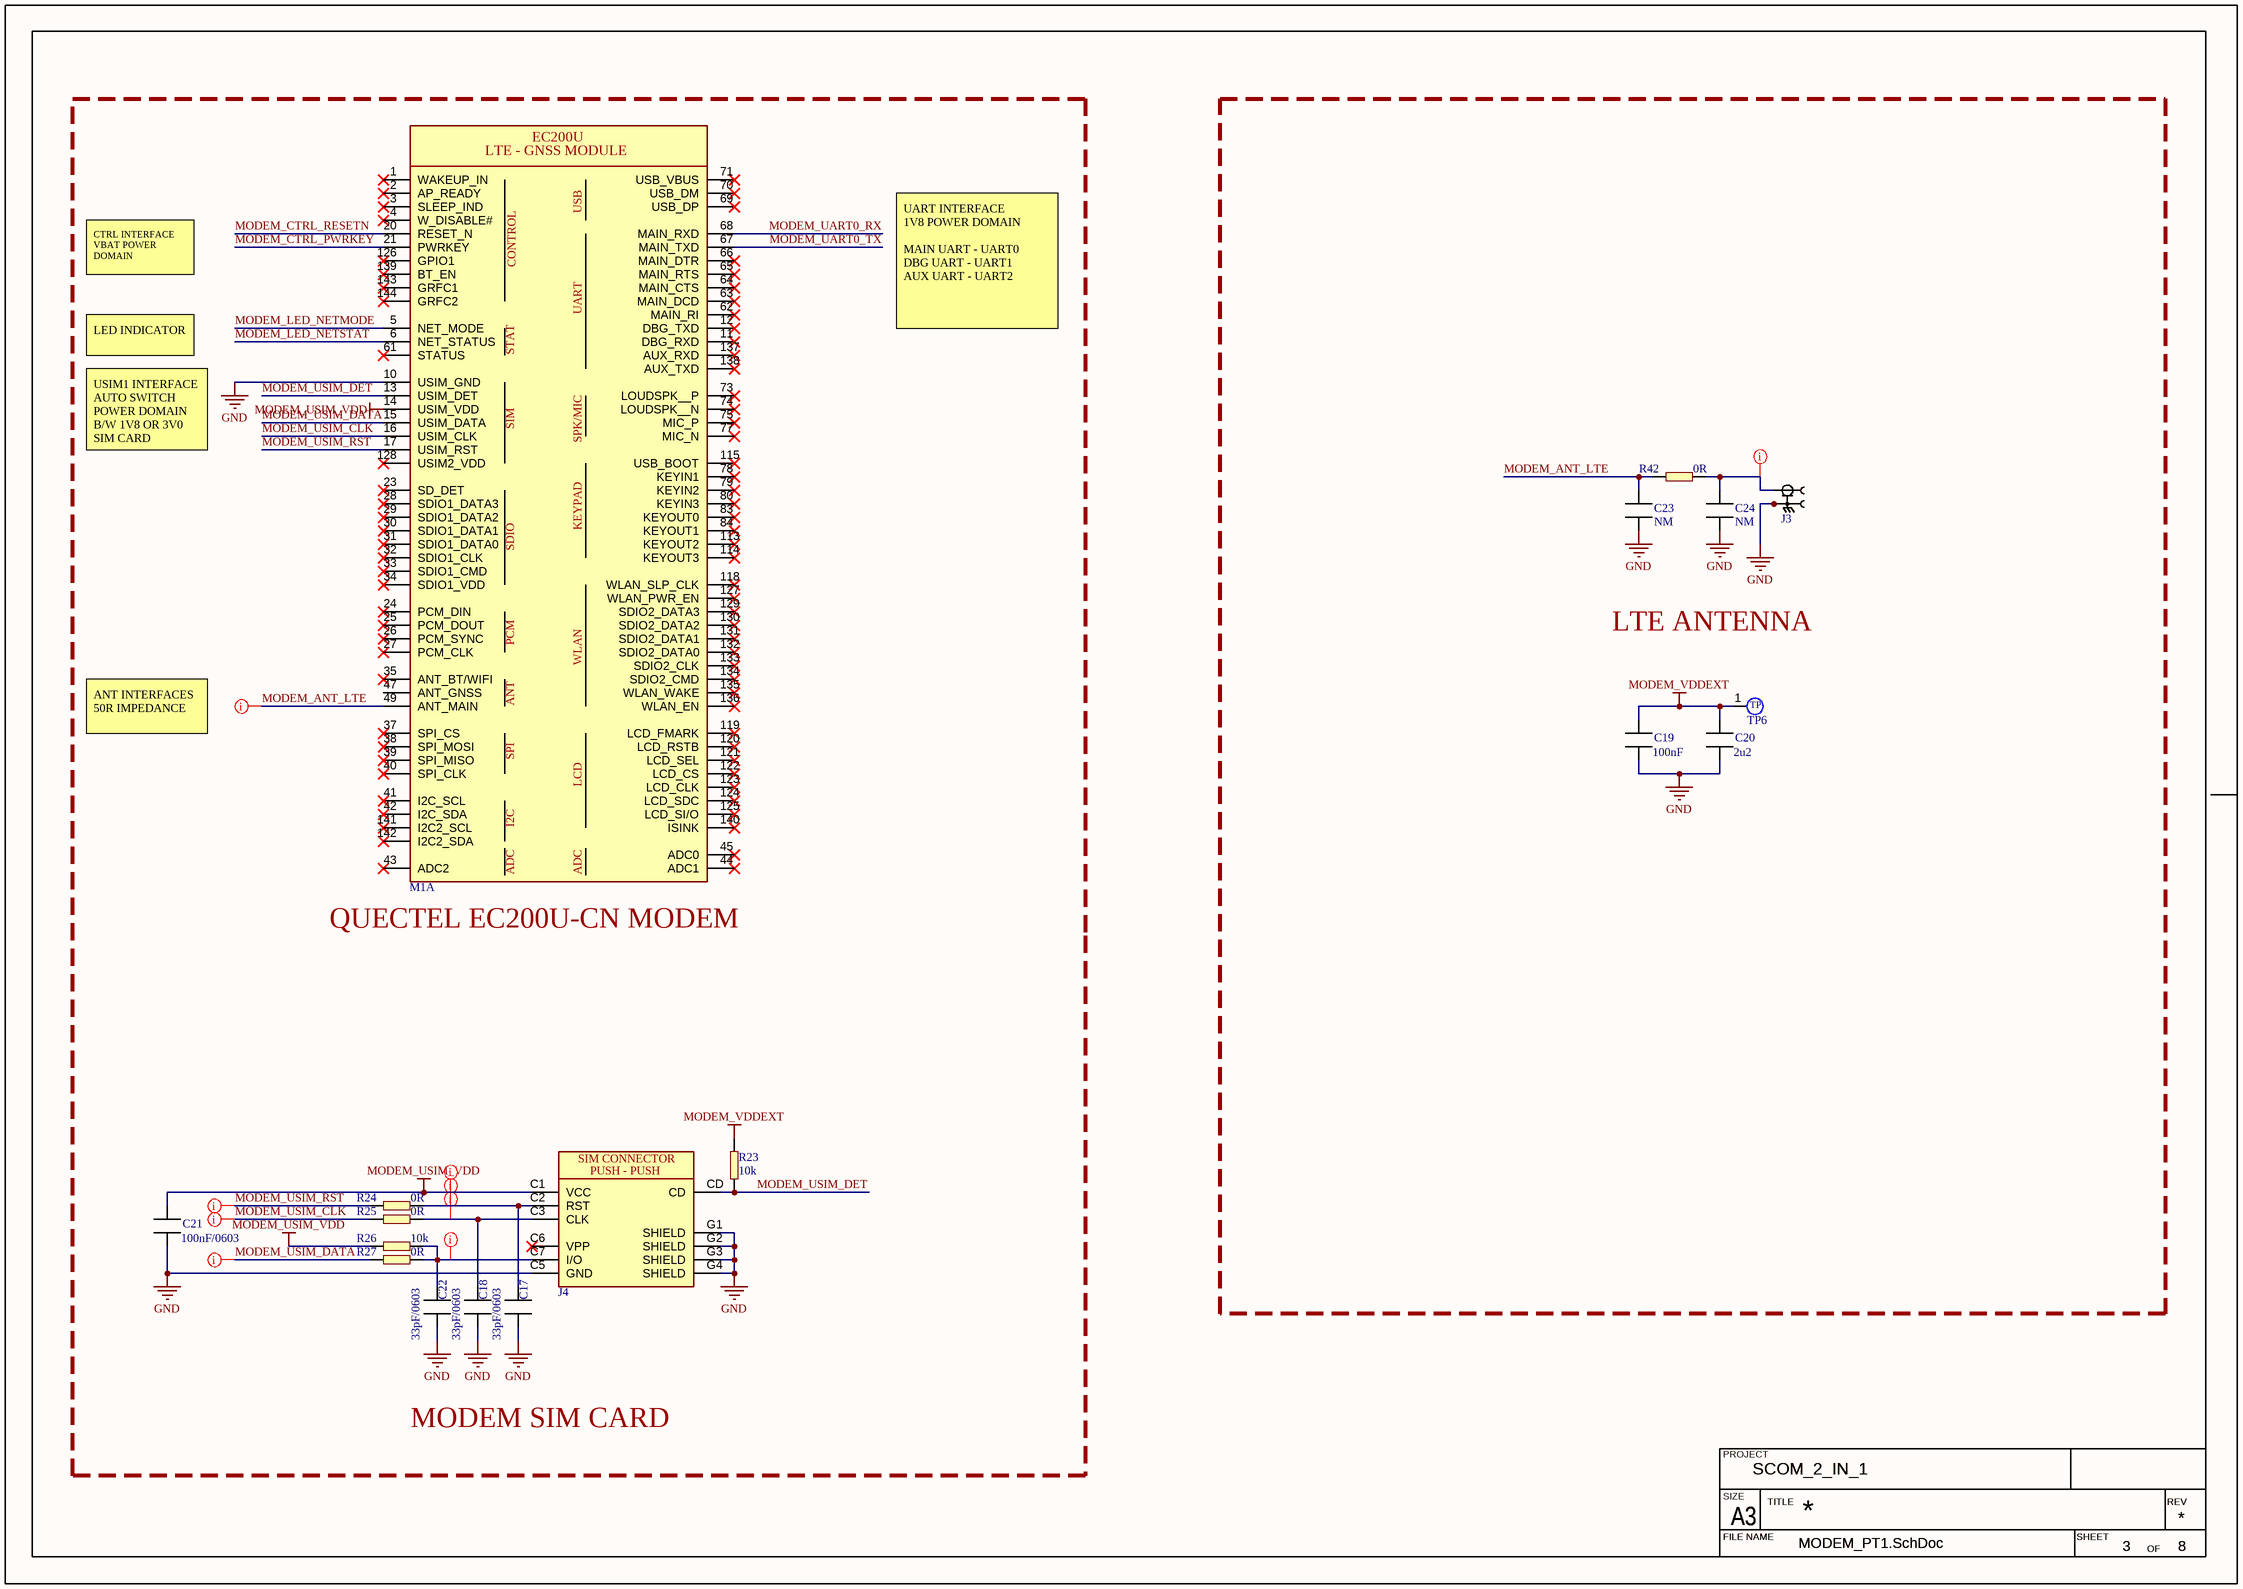
[diagram p4: MODEM_PT1.SchDoc]

### Parts
C17  value 33pF/0603  [CAPC1608X10N]  (hidden comment: ERP_102-1)
C18  value 33pF/0603  [CAPC1608X10N]  (hidden comment: ERP_102-1)
C19  value 100nF  [CAPC2012X13L]  (hidden comment: MLCC_0805)
C20  value 2u2  [CAPC2012X13L]  (hidden comment: MLCC_0805)
C21  value 100nF/0603  [CAPC1608X10N]  (hidden comment: ERP_102-1)
C22  value 33pF/0603  [CAPC1608X10N]  (hidden comment: ERP_102-1)
C23  value NM  [CAPC0603X03L]  (hidden comment: ERP_102-1)  (no BOM)
C24  value NM  [CAPC0603X03L]  (hidden comment: ERP_102-1)  (no BOM)
J3  ERP_148-1  [uFL_50R]  (value not drawn)
J4  MUP-7801-1  [MUP-7801-1]  (value not drawn)
M1  EC200U  [EC200U]  (value not drawn)  (part A of 2)
R23  value 10k  [RES_0603]  (hidden comment: ERP_101-1)
R24  value 0R  [RES_0603]  (hidden comment: ERP_101-1)
R25  value 0R  [RES_0603]  (hidden comment: ERP_101-1)
R26  value 10k  [RES_0603]  (hidden comment: ERP_101-1)
R27  value 0R  [RES_0603]  (hidden comment: ERP_101-1)
R42  value 0R  [RESC0603X03L]  (hidden comment: ERP_101-1)
TP6  TP_1MM  [TP_1MM]  (value not drawn)  (no BOM)

### Blocks framed on the sheet
LTE ANTENNA: C19 C20 C23 C24 J3 R42 TP6

### Nets
GND: C17.2 C18.2 C19.2 C20.2 C21.2 C22.2 C23.1 C24.1 J3.1 J3.2 J4.C5(GND) J4.G1(SHIELD) J4.G2(SHIELD) J4.G3(SHIELD) J4.G4(SHIELD) M1.10(USIM_GND)
MODEM_USIM_VDD: C21.1 J4.C1(VCC) M1.14(USIM_VDD) R26.2
MODEM_VDDEXT: C19.1 C20.1 R23.2 TP6.1
MODEM_ANT_LTE: C23.2 M1.49(ANT_MAIN) R42.2
MODEM_CTRL_PWRKEY: M1.21(PWRKEY)
MODEM_CTRL_RESETN: M1.20(RESET_N)
MODEM_LED_NETMODE: M1.5(NET_MODE)
MODEM_LED_NETSTAT: M1.6(NET_STATUS)
MODEM_UART0_RX: M1.68(MAIN_RXD)
MODEM_UART0_TX: M1.67(MAIN_TXD)
MODEM_USIM_CLK: M1.16(USIM_CLK) R25.2
MODEM_USIM_DATA: M1.15(USIM_DATA) R27.2
MODEM_USIM_DET: J4.CD M1.13(USIM_DET) R23.1
MODEM_USIM_RST: M1.17(USIM_RST) R24.2
NetC17_1: C17.1 J4.C2(RST) R24.1
NetC18_1: C18.1 J4.C3(CLK) R25.1
NetC22_1: C22.1 J4.C7(I/O) R26.1 R27.1
NetC24_2: C24.2 J3.3 R42.1

Not connected (* = marked no-connect by the designer): J4 C6(VPP)*; M1 1(WAKEUP_IN)* 2(AP_READY)* 3(SLEEP_IND)* 4(W_DISABLE#)* 11(DBG_RXD)* 12(DBG_TXD)* 23(SD_DET)* 24(PCM_DIN)* 25(PCM_DOUT)* 26(PCM_SYNC)* 27(PCM_CLK)* 28(SDIO1_DATA3)* 29(SDIO1_DATA2)* 30(SDIO1_DATA1)* 31(SDIO1_DATA0)* 32(SDIO1_CLK)* 33(SDIO1_CMD)* 34(SDIO1_VDD)* 35(ANT_BT/WIFI)* 37(SPI_CS)* 38(SPI_MOSI)* 39(SPI_MISO)* 40(SPI_CLK)* 41(I2C_SCL)* 42(I2C_SDA)* 43(ADC2)* 44(ADC1)* 45(ADC0)* 47(ANT_GNSS) 61(STATUS)* 62(MAIN_RI)* 63(MAIN_DCD)* 64(MAIN_CTS)* 65(MAIN_RTS)* 66(MAIN_DTR)* 69(USB_DP)* 70(USB_DM)* 71(USB_VBUS)* 73(LOUDSPK__P)* 74(LOUDSPK__N)* 75(MIC_P)* 77(MIC_N)* 78(KEYIN1)* 79(KEYIN2)* 80(KEYIN3)* 83(KEYOUT0)* 84(KEYOUT1)* 113(KEYOUT2)* 114(KEYOUT3)* 115(USB_BOOT)* 118(WLAN_SLP_CLK)* 119(LCD_FMARK)* 120(LCD_RSTB)* 121(LCD_SEL)* 122(LCD_CS)* 123(LCD_CLK)* 124(LCD_SDC)* 125(LCD_SI/O)* 126(GPIO1)* 127(WLAN_PWR_EN)* 128(USIM2_VDD)* 129(SDIO2_DATA3)* 130(SDIO2_DATA2)* 131(SDIO2_DATA1)* 132(SDIO2_DATA0)* 133(SDIO2_CLK)* 134(SDIO2_CMD)* 135(WLAN_WAKE)* 136(WLAN_EN)* 137(AUX_RXD)* 138(AUX_TXD)* 139(BT_EN)* 140(ISINK)* 141(I2C2_SCL)* 142(I2C2_SDA)* 143(GRFC1)* 144(GRFC2)*

### Layout directives
net class ANT_50R; rule Width Constraint [Pref Impedance = 50.00ohms    Min Impedance = 50.00ohms    Max Impedance = 50.00ohms]: MODEM_ANT_LTE, NetC24_2
rule Width Constraint [Pref Impedance = 50.00ohms    Min Impedance = 50.00ohms    Max Impedance = 50.00ohms]: MODEM_USIM_CLK, MODEM_USIM_DATA, MODEM_USIM_RST, MODEM_USIM_VDD, NetC17_1, NetC18_1, NetC22_1

### Notes on the sheet
- CTRL INTERFACE
  VBAT POWER DOMAIN
- UART INTERFACE
  1V8 POWER DOMAIN
  MAIN UART - UART0
  DBG UART - UART1
  AUX UART - UART2
- LED INDICATOR
- USIM1 INTERFACE
  AUTO SWITCH POWER DOMAIN B/W 1V8 OR 3V0 SIM CARD
- ANT INTERFACES
  50R IMPEDANCE
- (near M1) QUECTEL EC200U-CN MODEM
- MODEM SIM CARD
- PROJECT
- SIZE
- FILE NAME
- A3
- TITLE
- SHEET
- OF
- REV
- (in symbol EC200U, part A) LTE - GNSS MODULE; USB; CONTROL; UART; STAT; SIM; SPK/MIC; KEYPAD; SDIO; PCM; WLAN; ANT; SPI; LCD; I2C; ADC
- (in symbol MUP-7801-1) SIM CONNECTOR; PUSH - PUSH
- (in symbol TP_1MM) TP

### Library data of the parts
C17 C18 C21 C22 = MLCC_0603: Chip Capacitor, 2-Leads, Body 1.60x0.80mm, IPC Medium Density; Package: 0603; Manufacturer 1: *; Manufacturer Part Number 1: *
C19 C20 = MLCC_0805: as C49 on sheet MCU; Package: 0805; Manufacturer 1: *; Manufacturer Part Number 1: *
C23 C24 = MLCC_0201: as C47 on sheet MCU; Package: 0201; Manufacturer 1: *; Manufacturer Part Number 1: *
J3 = uFL_50R: Package: L3W3; Value: *; ERP: *; Manufacturer 1: *; Manufacturer Part Number 1: *; Supplier 1: *; Suuplier Part Number 1: *
J4 = MUP-7801-1: 7 (6 + 1) Position Card Connector NANO SIM Surface Mount, Right Angle Gold; Manufacturer Part Number 1: MUP-C7801-02; Manufacturer 1: MUP; Package: 7 (6 + 1); Value: *; Supplier Part Number 1: ST2103SD1921
M1 = EC200U: as M1 on sheet MODEM_PT2; Value: *
R23-R27 = RES_0603: Package: 0603; Manufacturer 1: *; Manufacturer Part Number 1: *
R42 = RES_0201: Package: 0201; Manufacturer 1: *; Manufacturer Part Number 1: *

## Sheet POWER.SchDoc: TP5100, POWER PATH
size 420 x 297 mm; SheetNumber: 2; SheetTotal: 8
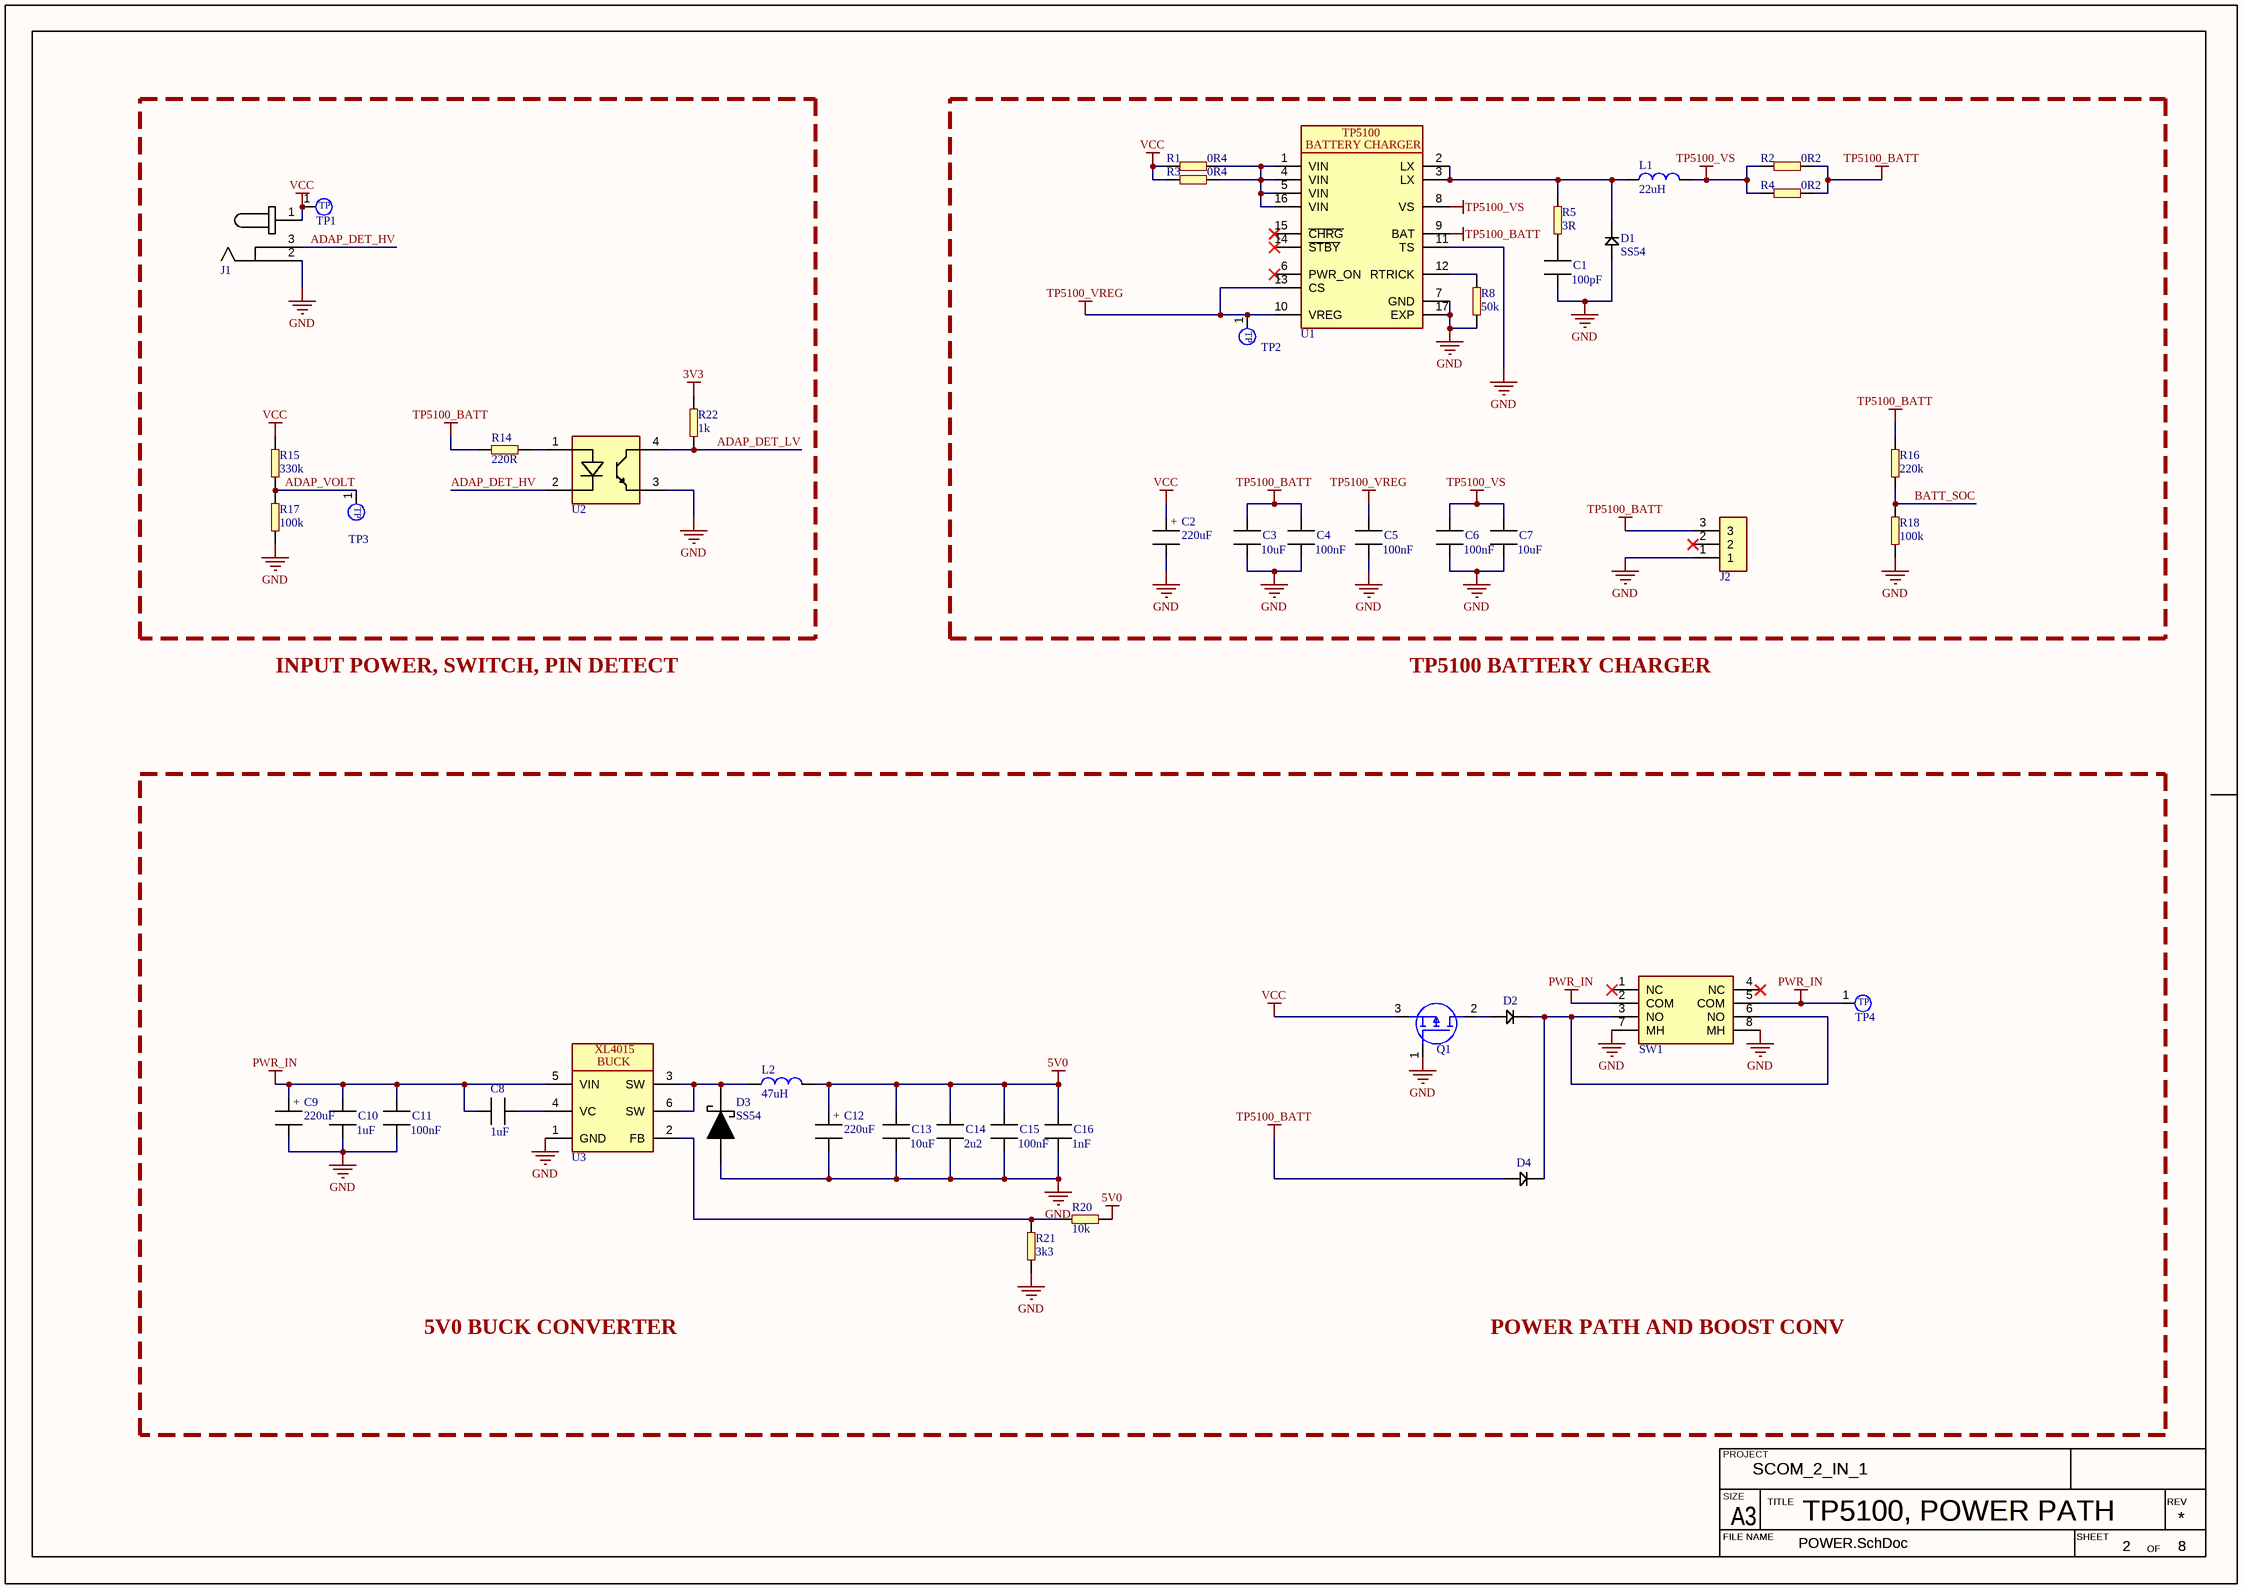
[diagram p5: POWER.SchDoc]

### Parts
C1  value 100pF  [CAPC2012X13L]  (hidden comment: MLCC_0805)
C2  value 220uF  [CAP_D10_H16_P5]  (hidden comment: ERP_102-2)
C3  value 10uF  [CAPC2012X13L]  (hidden comment: MLCC_0805)
C4  value 100nF  [CAPC2012X13L]  (hidden comment: MLCC_0805)
C5  value 100nF  [CAPC2012X13L]  (hidden comment: MLCC_0805)
C6  value 100nF  [CAPC2012X13L]  (hidden comment: MLCC_0805)
C7  value 10uF  [CAPC2012X13L]  (hidden comment: MLCC_0805)
C8  value 1uF  [CAPC2012X13L]  (hidden comment: MLCC_0805)
C9  value 220uF  [CAP_D10_H16_P5]  (hidden comment: ERP_102-2)
C10  value 1uF  [CAPC2012X13L]  (hidden comment: MLCC_0805)
C11  value 100nF  [CAPC2012X13L]  (hidden comment: MLCC_0805)
C12  value 220uF  [CAP_D10_H16_P5]  (hidden comment: ERP_102-2)
C13  value 10uF  [CAPC2012X13L]  (hidden comment: MLCC_0805)
C14  value 2u2  [CAPC2012X13L]  (hidden comment: MLCC_0805)
C15  value 100nF  [CAPC2012X13L]  (hidden comment: MLCC_0805)
C16  value 1nF  [CAPC2012X13L]  (hidden comment: MLCC_0805)
D1  value SS54  [DIOM6959X26L]  (hidden comment: ERP_104-3)
D2  ERP_104-3  [DIOM6959X26L]  (value not drawn)
D3  value SS54  [DIOM6959X26L]  (hidden comment: ERP_104-3)
D4  ERP_104-3  [DIOM6959X26L]  (value not drawn)
J1  KLDX-0202-AC  [KLDX-0202-AC]  (value not drawn)
J2  Molex_5.08_3P  [Molex_5.08_3P]  (value not drawn)
L1  value 22uH  [IND_1212]  (hidden comment: IND_1212)
L2  value 47uH  [IND_1212]  (hidden comment: ERP_103-3)
Q1  IRFR5305TRPBF  [DPAK229P991X239-3M]  (value not drawn)
R1  value 0R4  [RESC3116X06M]  (hidden comment: RES_1206)
R2  value 0R2  [RESC3116X06M]  (hidden comment: RES_1206)
R3  value 0R4  [RESC3116X06M]  (hidden comment: RES_1206)
R4  value 0R2  [RESC3116X06M]  (hidden comment: RES_1206)
R5  value 3R  [RES_0603]  (hidden comment: ERP_101-1)
R8  value 50k  [RES_0603]  (hidden comment: ERP_101-1)
R14  value 220R  [RES_0603]  (hidden comment: ERP_101-1)
R15  value 330k  [RES_0603]  (hidden comment: ERP_101-1)
R16  value 220k  [RES_0603]  (hidden comment: ERP_101-1)
R17  value 100k  [RES_0603]  (hidden comment: ERP_101-1)
R18  value 100k  [RES_0603]  (hidden comment: ERP_101-1)
R20  value 10k  [RES_0603]  (hidden comment: ERP_101-1)
R21  value 3k3  [RES_0603]  (hidden comment: ERP_101-1)
R22  value 1k  [RES_0603]  (hidden comment: ERP_101-1)
SW1  ERP_110-4  [PBH2U]  (value not drawn)
TP1  TP_1MM  [TP_1MM]  (value not drawn)  (no BOM)
TP2  TP_1MM  [TP_1MM]  (value not drawn)  (no BOM)
TP3  TP_1MM  [TP_1MM]  (value not drawn)  (no BOM)
TP4  TP_1MM  [TP_1MM]  (value not drawn)  (no BOM)
U1  TP5100  [QFN65P400X400X90_HS-17M]  (value not drawn)
U2  FOD817A3SD  [FOD817A3SD]  (value not drawn)
U3  XL4015  [XL4015]  (value not drawn)

### Nets
3V3: R22.2
5V0: C12.1 C13.1 C14.1 C15.1 C16.1 L2.1 R20.1
GND: C1.2 C2.2 C3.2 C4.2 C5.2 C6.2 C7.2 C9.2 C10.2 C11.2 C12.2 C13.2 C14.2 C15.2 C16.2 D1.2(A) D3.2(A) J1.2 J2.1 Q1.1(G) R8.1 R17.2 R18.1 R21.2 SW1.7(MH) SW1.8(MH) U1.7(GND) U1.11(TS) U1.17(EXP) U2.3(EMITTER) U3.1(GND)
PWR_IN: C8.1 C9.1 C10.1 C11.1 SW1.2(COM) SW1.5(COM) TP4.1 U3.5(VIN)
TP5100_BATT: C3.1 C4.1 D4.2(A) J2.3 R2.1 R4.1 R14.1 R16.2 U1.9(BAT)
TP5100_VREG: C5.1 TP2.1 U1.10(VREG) U1.13(CS)
TP5100_VS: C6.1 C7.1 L1.2 R2.2 R4.2 U1.8(VS)
VCC: C2.1 J1.1 Q1.3(S) R1.2 R3.2 R15.2 TP1.1
ADAP_DET_HV: J1.3 U2.2(CATHODE)
ADAP_DET_LV: R22.1 U2.4(COLLECTOR)
ADAP_VOLT: R15.1 R17.1 TP3.1
BATT_SOC: R16.1 R18.2
NetC1_1: C1.1 R5.1
NetC8_2: C8.2 U3.4(VC)
NetD1_1: D1.1(C) L1.1 R5.2 U1.2(LX) U1.3(LX)
NetD2_1: D2.1(C) D4.1(C) SW1.3(NO) SW1.6(NO)
NetD2_2: D2.2(A) Q1.2(D)
NetD3_1: D3.1(C) L2.2 U3.3(SW) U3.6(SW)
NetR1_1: R1.1 R3.1 U1.1(VIN) U1.4(VIN) U1.5(VIN) U1.16(VIN)
NetR8_2: R8.2 U1.12(RTRICK)
NetR14_2: R14.2 U2.1(ANODE)
NetR20_2: R20.2 R21.1 U3.2(FB)

Not connected (* = marked no-connect by the designer): J2 2*; SW1 1(NC)* 4(NC)*; U1 6(PWR_ON)* 14(~{STBY})* 15(~{CHRG})*

### Notes on the sheet
- INPUT POWER, SWITCH, PIN DETECT
- TP5100 BATTERY CHARGER
- 5V0 BUCK CONVERTER
- POWER PATH AND BOOST CONV
- PROJECT
- SIZE
- FILE NAME
- A3
- TITLE
- SHEET
- OF
- REV
- (in symbol CAP_D10_H16_P5) +
- (in symbol TP5100) BATTERY CHARGER
- (in symbol TP_1MM) TP
- (in symbol XL4015) BUCK

### Library data of the parts
C1 C11 C14-C16 = MLCC_0805: as C49 on sheet MCU; Package: 0805; Manufacturer 1: *; Manufacturer Part Number 1: *
C2 C9 C12 = CAP_D10_H16_P5: Electrolytic Capacitor Through Hole D10 P5.0; Package: 10X5; Manufacturer 1: *; Manufacturer Part Number 1: *; Supplier 1: *
C3-C8 C10 C13 = MLCC_0805: as C45 on sheet MCU; Package: 0805; Manufacturer 1: *; Manufacturer Part Number 1: *
D1 D3 = SS54: Supplier Part Number 1: *; Supplier  1: *; Package: SMC; Manufacturer Part Number 1: *; Manufacturer 1: *
  D3: ERP: *
D2 D4 = SS54: Value: SS54; Supplier Part Number 1: *; Supplier  1: *; Package: SMC; Manufacturer Part Number 1: *; Manufacturer 1: *
J1 = KLDX-0202-AC: CONN PWR JACK 2X5.5MM KINKED PIN; Manufacturer 1: Sharvi; Manufacturer Part Number 1: ST2001CO0701; Value: NA
J2 = Molex_5.08_3P: Molex 7A 5.08mm Connector 3 Pin; Manufacturer Part Number 1: *; Manufacturer 1: *; Value: *
L2 = IND_1212: Manufacturer 1: Würth Elektronik; Manufacturer Part Number 1: *
Q1 = IRFR5305TRPBF: P Channel MOSFET -55V HEXFET 65mOhms 42nC TO-252-3; Manufacturer 1: International Rectifier; Value: *; Supplier Part Number 1: *; Supplier 1: *; Manufacturer Part Number 1: IRFR5305TRPBF
R5 R8 R14-R18 R20-R22 = RES_0603: Package: 0603; Manufacturer 1: *; Manufacturer Part Number 1: *
SW1 = PBH2U: Pushbutton Switch DPDT Standard Through Hole, Right Angle; Manufacturer Part Number 1: ST2106CO3161; Manufacturer 1: Sharvi; Package: *; Value: *
U1 = TP5100: Switching-buck type (double 8.4V / single 4.2V) lithium battery charging management chip; Manufacturer 1: Top Power; Value: *; Manufacturer Part Number 1: TP5100; Supplier 1: *; Supplier Part Number 1: *
U2 = FOD817A3SD: OPTOISOLATOR 5KV TRANSISTOR 4SMD; Value: *; Manufacturer: *; Manufacturer Part Number 1: *
U3 = XL4015: 5A 180KHz 36V Buck DC to DC Converter; Manufacturer 1: XLSemi; Manufacturer Part Number 1: XL4015E1; Value: *
L1 = IND_1212: Manufacturer Part Number 1: *; Manufacturer 1: *; Supplier 1: *; Supplier Part Number 1: *
R1-R4 = RES_1206: Package: 1206; Manufacturer 1: *; Manufacturer Part Number 1: *; Supplier Part Number 1: *; Supplier 1: *

## Sheet POWERBUDGET.SchDoc
size 420 x 297 mm
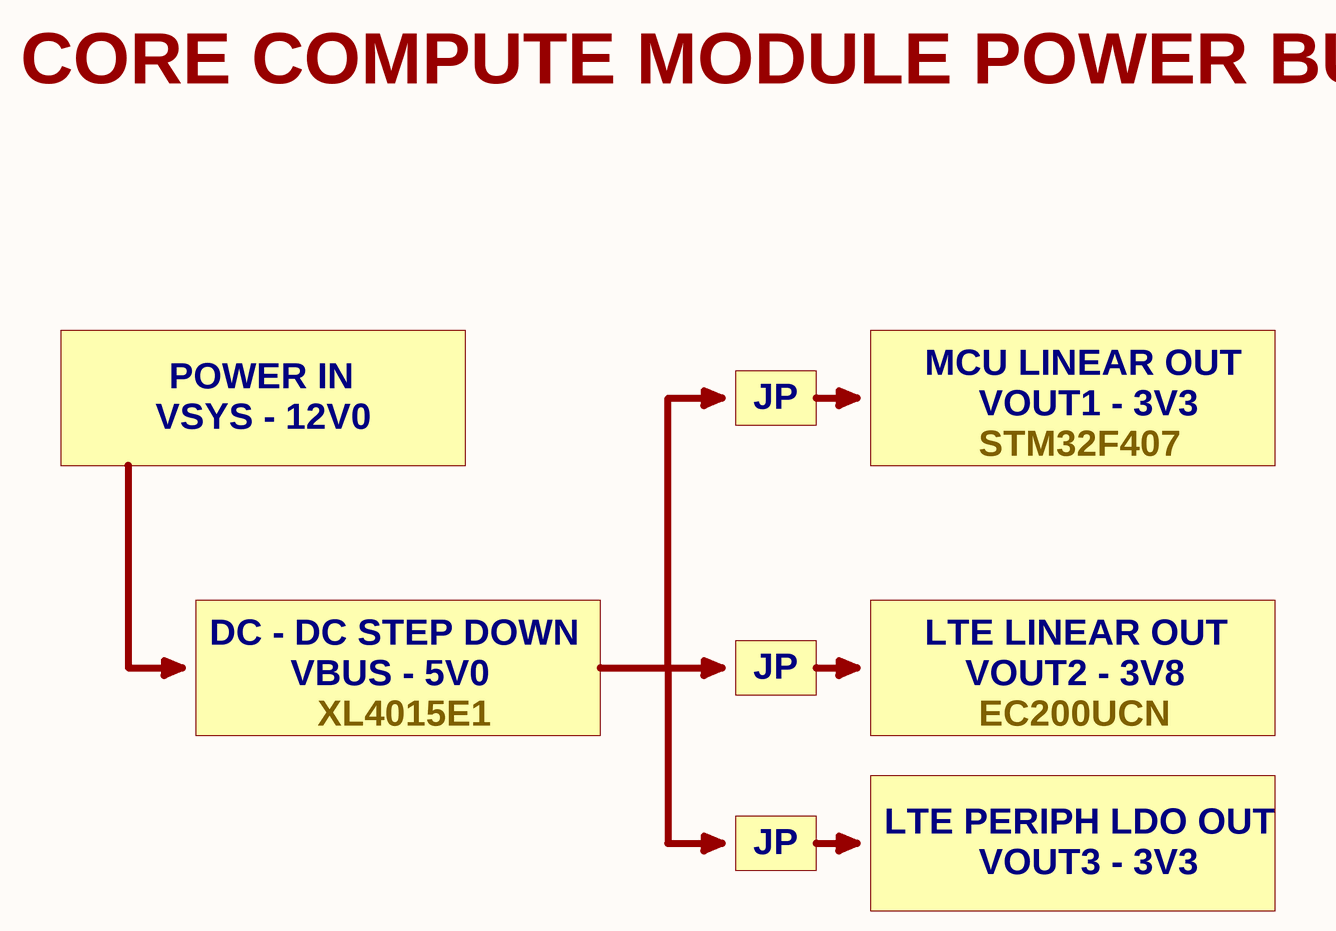
[diagram p6: POWERBUDGET.SchDoc]

### Notes on the sheet
- CORE COMPUTE MODULE POWER BUDGET
- POWER IN
- JP
- MCU LINEAR OUT
- VOUT1 - 3V3
- VSYS - 12V0
- STM32F407
- DC - DC STEP DOWN
- VBUS - 5V0
- LTE LINEAR OUT
- VOUT2 - 3V8
- XL4015E1
- EC200UCN
- LTE PERIPH LDO OUT
- VOUT3 - 3V3
- PROJECT
- SIZE
- FILE NAME
- A3
- TITLE
- SHEET
- OF
- REV

## Nets that join several sheets
3V3: MCU (19 pins), MODEM_PT2 (C31.1 U4.19), STORAGE (7 pins), POWER (R22.2)
5V0: MCU (C50.1 J11.1 R55.2 U7.3), MODEM_PT2 (R40.1 U5.2), POWER (7 pins)
GND: MCU (39 pins), MODEM_PT2 (64 pins), STORAGE (7 pins), MODEM_PT1 (16 pins), POWER (31 pins)
MODEM_VDDEXT: MODEM_PT2 (6 pins), MODEM_PT1 (C19.1 C20.1 R23.2 TP6.1)
ADAP_DET_LV: MCU (M2.5), POWER (R22.1 U2.4)
ADAP_VOLT: MCU (M2.6), POWER (R15.1 R17.1 TP3.1)
BATT_SOC: MCU (M2.7), POWER (R16.1 R18.2)
LTE_RX: MCU (M2.26), MODEM_PT2 (U4.18)
LTE_TX: MCU (M2.29), MODEM_PT2 (U4.16)
MCU_MODEM_PWRKEY_3V3: MCU (M2.8), MODEM_PT2 (R37.2)
MCU_MODEM_RESETN_3V3: MCU (M2.9), MODEM_PT2 (R35.2)
MODEM_CTRL_PWRKEY: MODEM_PT2 (Q3.3), MODEM_PT1 (M1.21)
MODEM_CTRL_RESETN: MODEM_PT2 (Q2.3), MODEM_PT1 (M1.20)
MODEM_LED_NETMODE: MODEM_PT2 (R36.2), MODEM_PT1 (M1.5)
MODEM_LED_NETSTAT: MODEM_PT2 (R34.2), MODEM_PT1 (M1.6)
MODEM_UART0_RX: MODEM_PT2 (U4.5), MODEM_PT1 (M1.68)
MODEM_UART0_TX: MODEM_PT2 (U4.3), MODEM_PT1 (M1.67)
SD_CS: MCU (M2.27), STORAGE (J5.2 R31.1)
SD_MISO: MCU (M2.31), STORAGE (J5.7 R28.1)
SD_MOSI: MCU (M2.37), STORAGE (J5.3 R30.1)
SD_SCLK: MCU (M2.30), STORAGE (J5.5 R29.1)

## Assembly variants
Sensor: not fitted C17 C18 C19 C20 C21 C22 C23 C24 C26 C27 C29 C31 C33 C34 C35 C36 C37 C38 C39 C40 C41 C42 C43 C44 C45 C46 D5 D6 J3 J4 J5 J6 M1 Q2 Q3 R23 R24 R25 R26 R27 R28 R29 R30 R31 R32 R33 R34 R35 R36 R37 R38 R39 R40 R41 R42 R44 R45 R46 R47 U4 U5 U6
Gateway: not fitted J8 J10 J14 J15 J16 M3 R50 R52 R53